# Altium project APP_1_huom2704.PrjPcb (part 1 of 2)
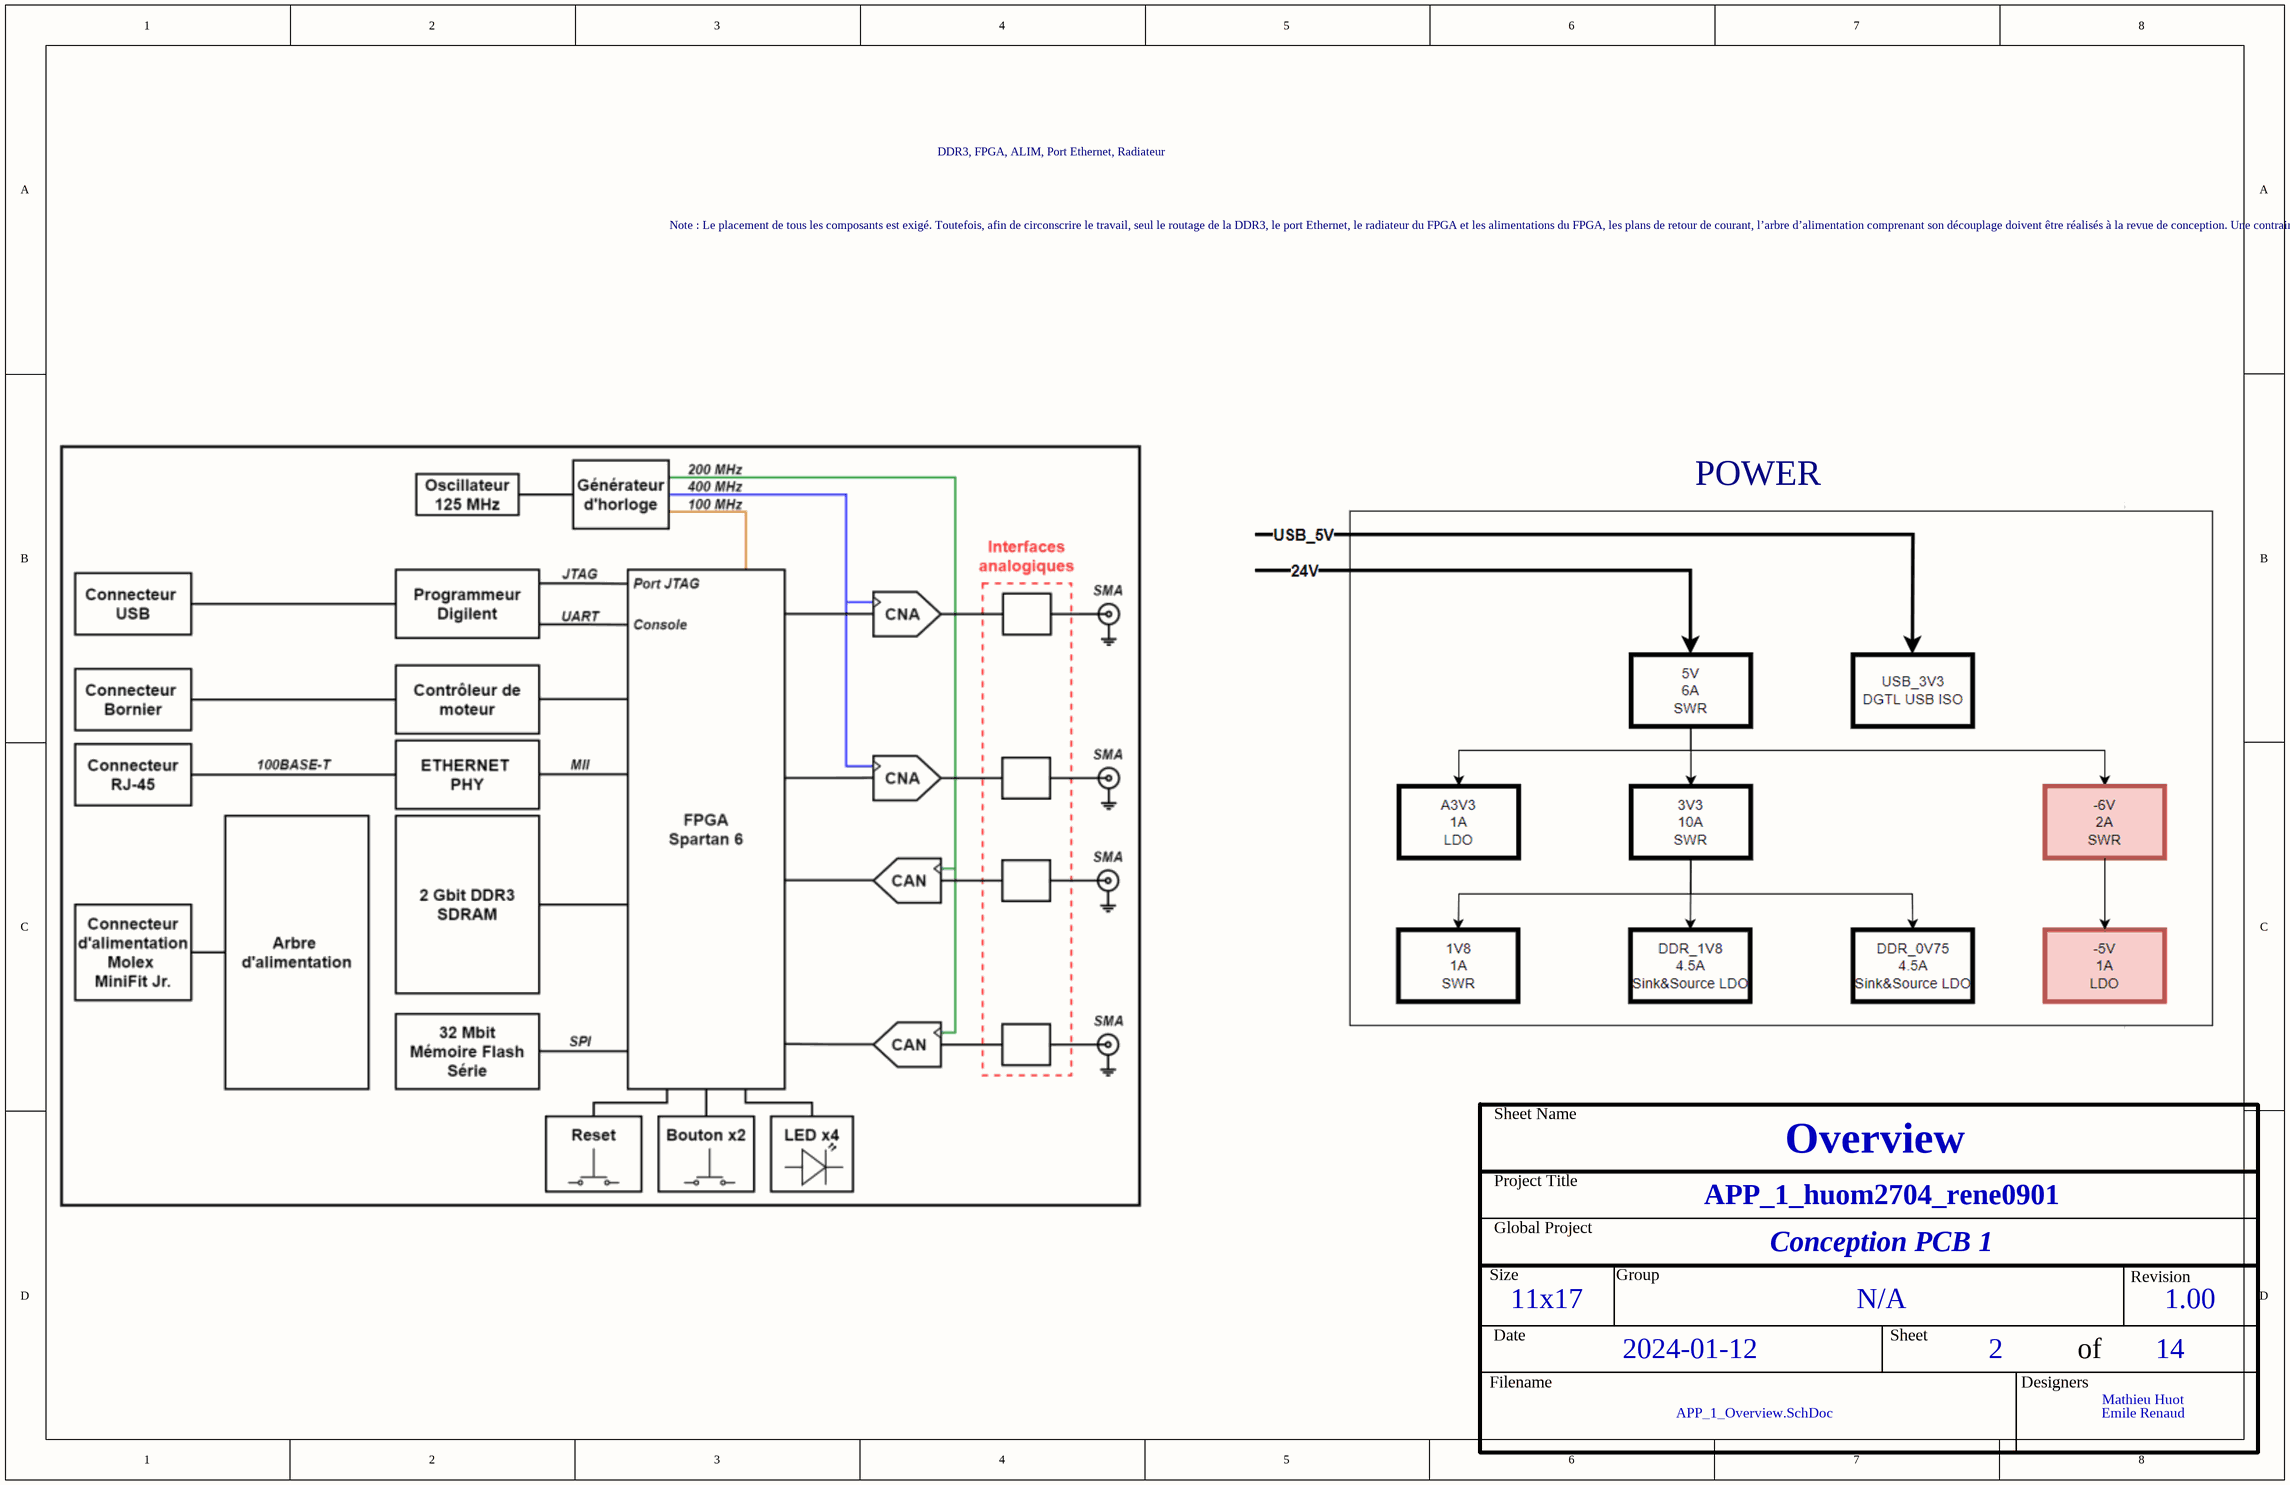
[diagram p0: APP_1_Overview.SchDoc]
Project_Date: 2024-01-12; Project_Designer1: Mathieu Huot; Project_Designer2: Emile Renaud; Project_Global: Conception PCB 1; Project_Group: N/A; Project_Name: APP_1_huom2704_rene0901; Project_Revision: 1.00
8 sheets, 180 parts. Net scope: flat (ports and power ports of the same name join across sheets).
Board file: APP_EMILE.PcbDoc
Sheets:
  APP_1_Overview.SchDoc
  APP_1_Ethernet_m.SchDoc
  APP_1_FPGA_m.SchDoc
  APP_1_PLL_m.SchDoc
  APP_1_DAC_m.SchDoc
  APP_1_ADC_m.SchDoc
  APP_1_JTAG_m.SchDoc
  APP_1_PowerAnalog.SchDoc

## Sheet APP_1_Overview.SchDoc: Overview
size Tabloid; DocumentNumber: 2; SheetNumber: 2; SheetTotal: 14; Sheet_Name: Overview; Size: 11x17

### Notes on the sheet
- DDR3, FPGA, ALIM, Port Ethernet, Radiateur
- Note : Le placement de tous les composants est exigé. Toutefois, afin de circonscrire le travail, seul le routage de la DDR3, le port Ethernet, le radiateur du FPGA et les alimentations du FPGA, les plans de retour de courant, l’arbre d’alimentation comprenant son découplage doivent être réalisés à la revue de conception. Une contrainte est exigée pour le routage entre le FPGA et la DDR3 où on exige une distance de 2 cm entre les 2 composants. Il faut spécifier, sans router les traces (épaisseurs, largeur, vias etc…) du contrôleur de moteur jusqu’au connecteur. L’équipe doit fournir un mini rapport de 1 page expliquant les choix technologiques pour l’empilement (stack-up), les matériaux et les épaisseurs de cuivre. Cette page correspond à votre travail en tant qu’ingénieur de conception.
- POWER
- Sheet Name
- Project Title
- Global Project
- Size
- Group
- Revision
- Date
- Sheet
- of
- Filename
- Designers

## Sheet APP_1_Ethernet_m.SchDoc
size Tabloid; SheetNumber: 11; SheetTotal: 16; Sheet_Name: Ethernet; Size: 11x17
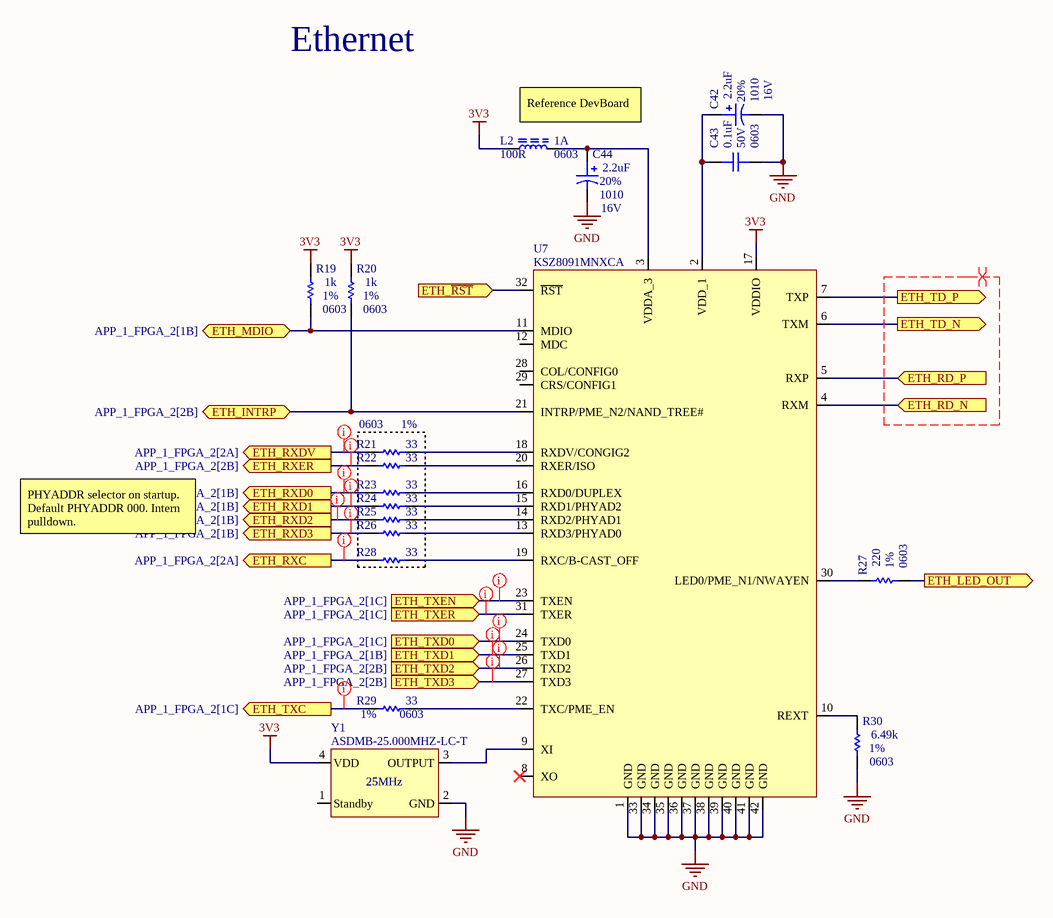
[diagram p1: APP_1_Ethernet_m.SchDoc]

### Parts
C42  value 2.2uF  Voltage: 16V  Package: 1010  Precision: 20%  [CAP_ALU_1010_vishay]  (hidden comment: MAL214699501E3)
C43  value 0.1uF  Voltage: 50V  Package: 0603  [CAP_0603]  (hidden comment: CAP - 0603)
C44  value 2.2uF  Voltage: 16V  Package: 1010  Precision: 20%  [CAP_ALU_1010_vishay]  (hidden comment: MAL214699501E3)
L2  value 100R  Current: 1A  Package: 0603  [FER_0603]  (hidden comment: FER - 0603)
R19  value 1k  Package: 0603  Precision: 1%  [RES_0603]  (hidden comment: RES - 0603)
R20  value 1k  Package: 0603  Precision: 1%  [RES_0603]  (hidden comment: RES - 0603)
R21  value 33  Package: 0603  Precision: 1%  [RES_0603]  (hidden comment: RES - 0603)
R22  value 33  [RES_0603]  (hidden comment: RES - 0603)
R23  value 33  [RES_0603]  (hidden comment: RES - 0603)
R24  value 33  [RES_0603]  (hidden comment: RES - 0603)
R25  value 33  [RES_0603]  (hidden comment: RES - 0603)
R26  value 33  [RES_0603]  (hidden comment: RES - 0603)
R27  value 220  Package: 0603  Precision: 1%  [RES_0603]  (hidden comment: RES - 0603)
R28  value 33  [RES_0603]  (hidden comment: RES - 0603)
R29  value 33  Package: 0603  Precision: 1%  [RES_0603]  (hidden comment: RES - 0603)
R30  value 6.49k  Package: 0603  Precision: 1%  [RES_0603]  (hidden comment: RES - 0603)
U7  KSZ8091MNXCA  [COM_ETH_PHY_KSZ8091MNXCA]
Y1  ASDMB-25.000MHZ-LC-T  [OSC_ASDMB-25.000MHZ-LC-T]

### Ports
ETH_INTRP (bidir, see APP_1_FPGA_2[2B]), ETH_LED_OUT (out), ETH_MDIO (bidir, see APP_1_FPGA_2[1B]), ETH_RD_N (in, see APP_1_Connectors_m[6B]), ETH_RD_P (in, see APP_1_Connectors_m[6B]), ETH_RXC (out, see APP_1_FPGA_2[2A]), ETH_RXD0 (out, see APP_1_FPGA_2[1B]), ETH_RXD1 (out, see APP_1_FPGA_2[1B]), ETH_RXD2 (out, see APP_1_FPGA_2[1B]), ETH_RXD3 (out, see APP_1_FPGA_2[1B]), ETH_RXDV (out, see APP_1_FPGA_2[2A]), ETH_RXER (out, see APP_1_FPGA_2[2B]), ETH_TD_N (out, see APP_1_Connectors_m[6B]), ETH_TD_P (out, see APP_1_Connectors_m[6B]), ETH_TXC (out, see APP_1_FPGA_2[1C]), ETH_TXD0 (in, see APP_1_FPGA_2[1C]), ETH_TXD1 (in, see APP_1_FPGA_2[1B]), ETH_TXD2 (in, see APP_1_FPGA_2[2B]), ETH_TXD3 (in, see APP_1_FPGA_2[2B]), ETH_TXEN (in, see APP_1_FPGA_2[1C]), ETH_TXER (in, see APP_1_FPGA_2[1C]), ETH_~{RST} (in)

### Nets
3V3: L2.2 R19.2 R20.2 U7.17(VDDIO) Y1.4(VDD)
GND: C42.2 C43.1 C44.2 R30.1 U7.1(GND) U7.33(GND) U7.34(GND) U7.35(GND) U7.36(GND) U7.37(GND) U7.38(GND) U7.39(GND) U7.40(GND) U7.41(GND) U7.42(GND) Y1.2(GND)
ETH_INTRP: R20.1 U7.21(INTRP/PME_N2/NAND_TREE#) ; port ETH_INTRP
ETH_LED_OUT: R27.1 ; port ETH_LED_OUT
ETH_MDIO: R19.1 U7.11(MDIO) ; port ETH_MDIO
ETH_~{RST}: U7.32(~{RST}) ; port ETH_~{RST}
ETH_RD_N: U7.4(RXM) ; port ETH_RD_N
ETH_RD_P: U7.5(RXP) ; port ETH_RD_P
ETH_RXC: R28.2 ; port ETH_RXC
ETH_RXD0: R23.2 ; port ETH_RXD0
ETH_RXD1: R24.2 ; port ETH_RXD1
ETH_RXD2: R25.2 ; port ETH_RXD2
ETH_RXD3: R26.2 ; port ETH_RXD3
ETH_RXDV: R21.2 ; port ETH_RXDV
ETH_RXER: R22.2 ; port ETH_RXER
ETH_TD_N: U7.6(TXM) ; port ETH_TD_N
ETH_TD_P: U7.7(TXP) ; port ETH_TD_P
ETH_TXC: R29.2 ; port ETH_TXC
ETH_TXD0: U7.24(TXD0) ; port ETH_TXD0
ETH_TXD1: U7.25(TXD1) ; port ETH_TXD1
ETH_TXD2: U7.26(TXD2) ; port ETH_TXD2
ETH_TXD3: U7.27(TXD3) ; port ETH_TXD3
ETH_TXEN: U7.23(TXEN) ; port ETH_TXEN
ETH_TXER: U7.31(TXER) ; port ETH_TXER
NetC42_1: C42.1 C43.2 U7.2(VDD_1)
NetC44_1: C44.1 L2.1 U7.3(VDDA_3)
NetR21_1: R21.1 U7.18(RXDV/CONGIG2)
NetR22_1: R22.1 U7.20(RXER/ISO)
NetR23_1: R23.1 U7.16(RXD0/DUPLEX)
NetR24_1: R24.1 U7.15(RXD1/PHYAD2)
NetR25_1: R25.1 U7.14(RXD2/PHYAD1)
NetR26_1: R26.1 U7.13(RXD3/PHYAD0)
NetR27_2: R27.2 U7.30(LED0/PME_N1/NWAYEN)
NetR28_1: R28.1 U7.19(RXC/B-CAST_OFF)
NetR29_1: R29.1 U7.22(TXC/PME_EN)
NetR30_2: R30.2 U7.10(REXT)
NetU7_9: U7.9(XI) Y1.3(OUTPUT)

Not connected (* = marked no-connect by the designer): U7 8(XO)* 12(MDC) 28(COL/CONFIG0) 29(CRS/CONFIG1); Y1 1(Standby)

### Layout directives
differential pair: (no net found under the mark)
net class ETH_RX: ETH_RXC, ETH_RXD0, ETH_RXD1, ETH_RXD2, ETH_RXD3, ETH_RXDV, ETH_RXER
net class ETH_TX: ETH_TXC, ETH_TXD0, ETH_TXD1, ETH_TXD2, ETH_TXD3, ETH_TXEN, ETH_TXER

### Notes on the sheet
- Ethernet
- Reference DevBoard
- PHYADDR selector on startup. Default PHYADDR 000. Intern pulldown.
- Sheet Name
- Project Title
- Global Project
- Size
- Group
- Revision
- Date
- Sheet
- of
- Filename
- Designers

### Library data of the parts
C42 C44 = CAP_ALU_MAL214699501E3: CAP - ALU 330uF 20% 16V - 1010; Current: 750mA; Mfg: Vishay Dale; Mfg Part Number: MAL214699501E3; HelpURL: http://www.vishay.com/docs/28403/146cti.pdf; CreatedBy: Jonathan Bouchard; Temperature: -55°C to 125°C; Power: *; Supplier 1: Digikey; Supplier Part Number 1: 4405PHCT-ND
C43 = CAP - 0603: Precision: 10%; Current: *; CreatedBy: Jonathan Bouchard; Power: *
R22-R26 R28 = RES - 0603: Precision: 1%; Current: *; CreatedBy: Jonathan Bouchard; Package: 0603
U7 = COM_ETH_PHY_KSZ8091MNXCA: COM - ETHERNET PHY 10/100 - QFN-32; Voltage: 1.8V, 2.5V, 3.3V; Mfg: Micrel; Current: *; Power: *; Mfg Part Number: KSZ8091MNXCA; HelpURL: http://ww1.microchip.com/downloads/en/DeviceDoc/00002275A.pdf; CreatedBy: Jonathan Bouchard; Temperature: 0°C ~ 70°C; Value: *; Precision: *; Package: QFN-32; Supplier 1: Digikey; Supplier Part Number 1: 576-4356-ND
Y1 = OSC_ASDMB-25.000MHZ-LC-T: OSC - 25MHz XO (Standard) LVCMOS - 4-SMD, No Lead; Manufacturer #1: Abracon LLC; Tolerance: ±50ppm; Voltage Rating: 1.8V ~ 3.3V; GRAMS Lib Spec: 2.8; Magnetic Material: Unknown; Polarized: Yes; Value: 25MHz; Current Rating: *; Power Max: *; HelpURL: https://abracon.com/Oscillators/ASDMB.pdf; CreatedBy/Date: Joël Lemay 2019-03-29; VerifiedBy: C. Paulin - 29 mai 2019; Temperature: -40°C ~ +85°C; Package: 4-SMD, No Lead; Manufacturer #2: *; Note: *; Assembly Type: SMD; Part Number #2: *; Part Number #1: ASDMB-25.000MHZ-LC-T; Supplier 1: Digi-Key; Supplier Part Number 1: 535-11730-1-ND; Cryo: UNKNOWN
L2 = FER - 0603: Voltage: *; CreatedBy: Jonathan Bouchard; Power: *; Precision: *
R19-R21 R27 R29 R30 = RES - 0603: Current: *; CreatedBy: Jonathan Bouchard

## Sheet APP_1_FPGA_m.SchDoc
size Tabloid; SheetNumber: 5; SheetTotal: 16; Sheet_Name: FPGA_m; Size: 11x17
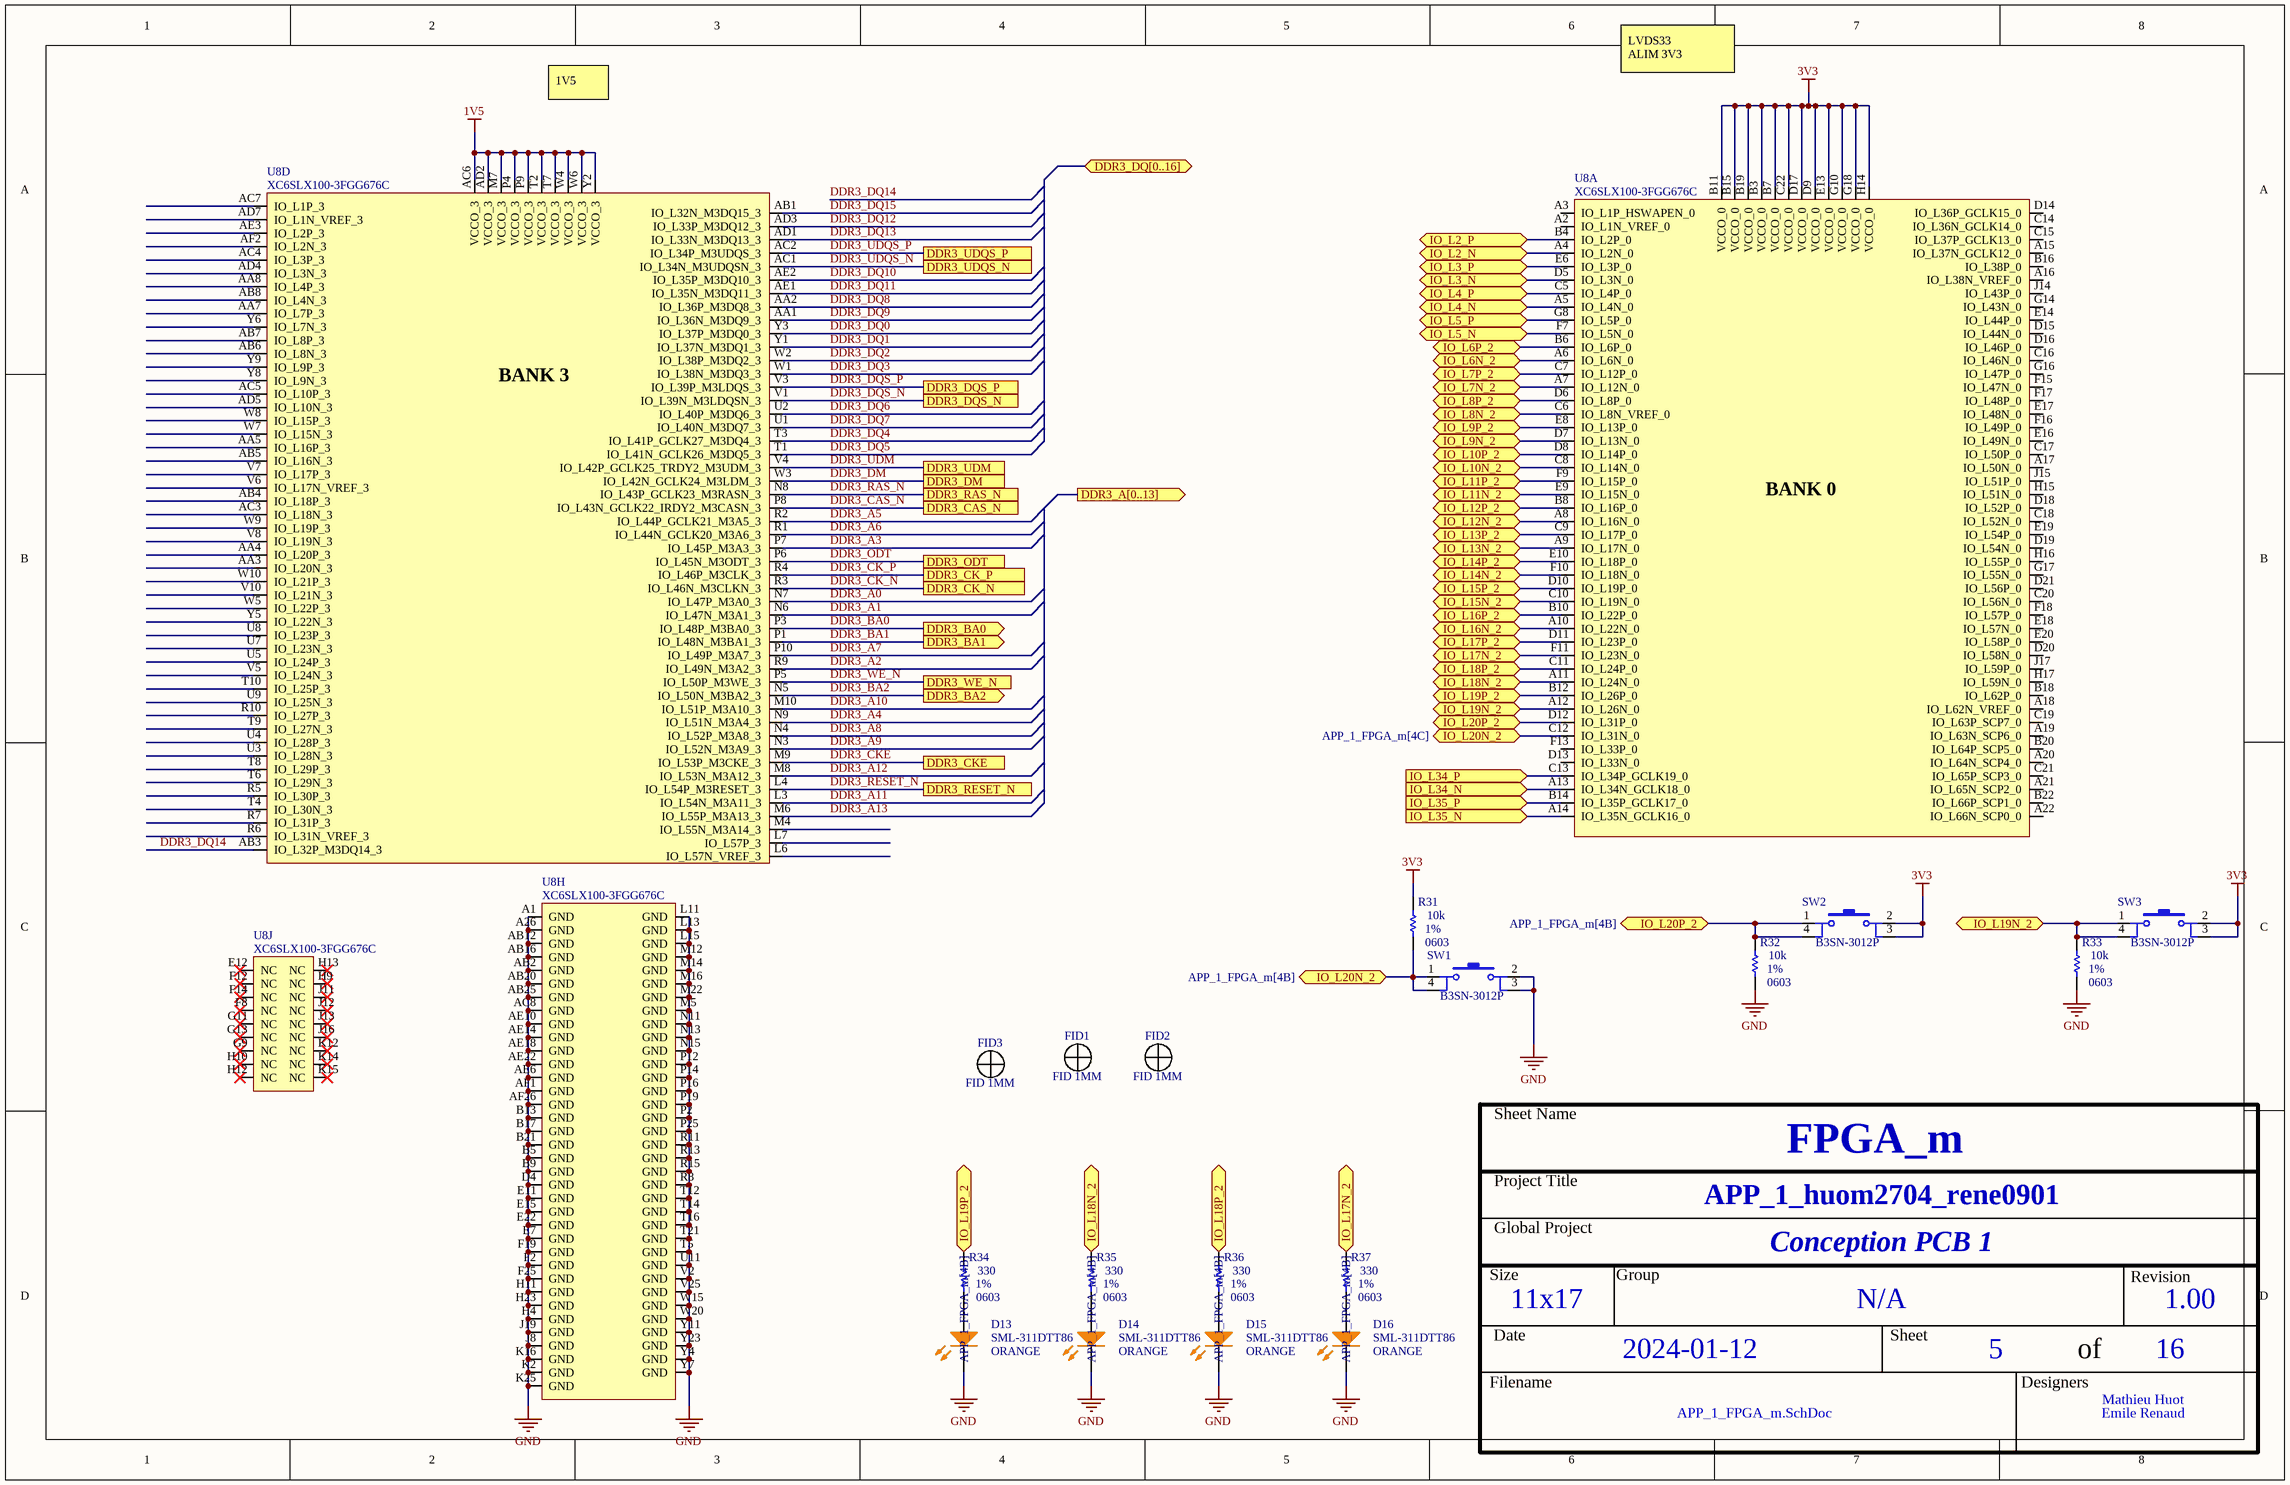
[diagram p2: APP_1_FPGA_m.SchDoc]

### Parts
D13  SML-311DTT86  value ORANGE  [LED_0603]
D14  SML-311DTT86  value ORANGE  [LED_0603]
D15  SML-311DTT86  value ORANGE  [LED_0603]
D16  SML-311DTT86  value ORANGE  [LED_0603]
FID1  FID 1MM  [FID_CIRCLE_1MM]
FID2  FID 1MM  [FID_CIRCLE_1MM]
FID3  FID 1MM  [FID_CIRCLE_1MM]
R31  value 10k  Package: 0603  Precision: 1%  [RES_0603]  (hidden comment: RES - 0603)
R32  value 10k  Package: 0603  Precision: 1%  [RES_0603]  (hidden comment: RES - 0603)
R33  value 10k  Package: 0603  Precision: 1%  [RES_0603]  (hidden comment: RES - 0603)
R34  value 330  Package: 0603  Precision: 1%  [RES_0603]  (hidden comment: RES - 0603)
R35  value 330  Package: 0603  Precision: 1%  [RES_0603]  (hidden comment: RES - 0603)
R36  value 330  Package: 0603  Precision: 1%  [RES_0603]  (hidden comment: RES - 0603)
R37  value 330  Package: 0603  Precision: 1%  [RES_0603]  (hidden comment: RES - 0603)
SW1  B3SN-3012P  [SWI_TACT_B3SN-3012P]
SW2  B3SN-3012P  [SWI_TACT_B3SN-3012P]
SW3  B3SN-3012P  [SWI_TACT_B3SN-3012P]
U8  XC6SLX100-3FGG676C  [FPGA_XILINX_FGG676]  (parts A,D,H,J of 10)

### Ports
DDR3_A[0..13] (out, see APP_1_DDR3_m[1B]), DDR3_BA0 (out, see APP_1_DDR3_m[2C]), DDR3_BA1 (out, see APP_1_DDR3_m[2C]), DDR3_BA2 (out, see APP_1_DDR3_m[2C]), DDR3_CAS_N (see APP_1_DDR3_m[2C]), DDR3_CK_N (see APP_1_DDR3_m[1C]), DDR3_CK_P (see APP_1_DDR3_m[1C]), DDR3_CKE, DDR3_DM, DDR3_DQ[0..16] (bidir, see APP_1_DDR3_m[4B]), DDR3_DQS_N, DDR3_DQS_P, DDR3_ODT (see APP_1_DDR3_m[2C]), DDR3_RAS_N (see APP_1_DDR3_m[2C]), DDR3_RESET_N, DDR3_UDM (see APP_1_DDR3_m[4C]), DDR3_UDQS_N (see APP_1_DDR3_m[4C]), DDR3_UDQS_P (see APP_1_DDR3_m[4C]), DDR3_WE_N (see APP_1_DDR3_m[2C]), IO_L2_N (bidir), IO_L2_P (bidir), IO_L3_N (bidir), IO_L3_P (bidir), IO_L4_N (bidir), IO_L4_P (bidir), IO_L5_N (bidir), IO_L5_P (bidir), IO_L6N_2 (bidir), IO_L6P_2 (bidir), IO_L7N_2 (bidir), IO_L7P_2 (bidir), IO_L8N_2 (bidir), IO_L8P_2 (bidir), IO_L9N_2 (bidir), IO_L9P_2 (bidir), IO_L10N_2 (bidir), IO_L10P_2 (bidir), IO_L11N_2 (bidir), IO_L11P_2 (bidir), IO_L12N_2 (bidir), IO_L12P_2 (bidir), IO_L13N_2 (bidir), IO_L13P_2 (bidir), IO_L14N_2 (bidir), IO_L14P_2 (bidir), IO_L15N_2 (bidir), IO_L15P_2 (bidir), IO_L16N_2 (bidir), IO_L16P_2 (bidir), IO_L17N_2 (bidir), IO_L17N_2 (bidir, see APP_1_FPGA_m[4B]), IO_L17P_2 (bidir), IO_L18N_2 (bidir), IO_L18N_2 (bidir, see APP_1_FPGA_m[4B]), IO_L18P_2 (bidir), IO_L18P_2 (bidir, see APP_1_FPGA_m[4B]), IO_L19N_2 (bidir), IO_L19P_2 (bidir), IO_L19P_2 (bidir, see APP_1_FPGA_m[4B]), IO_L20N_2 (bidir, see APP_1_FPGA_m[4B]), IO_L20N_2 (bidir, see APP_1_FPGA_m[4C]), IO_L20P_2 (bidir), IO_L20P_2 (bidir, see APP_1_FPGA_m[4B]), IO_L34_N (in), IO_L34_P (in), IO_L35_N (in), IO_L35_P (in)

### Nets
1V5: U8.AC6(VCCO_3) U8.AD2(VCCO_3) U8.M7(VCCO_3) U8.P4(VCCO_3) U8.P9(VCCO_3) U8.T2(VCCO_3) U8.T7(VCCO_3) U8.W4(VCCO_3) U8.W6(VCCO_3) U8.Y2(VCCO_3)
3V3: R31.2 SW2.2 SW2.3 SW3.2 SW3.3 U8.B3(VCCO_0) U8.B7(VCCO_0) U8.B11(VCCO_0) U8.B15(VCCO_0) U8.B19(VCCO_0) U8.C22(VCCO_0) U8.D9(VCCO_0) U8.D17(VCCO_0) U8.E13(VCCO_0) U8.G10(VCCO_0) U8.G18(VCCO_0) U8.H14(VCCO_0)
GND: D13.K D14.K D15.K D16.K R32.1 R33.1 SW1.2 SW1.3 U8.A1(GND) U8.A26(GND) U8.AB2(GND) U8.AB12(GND) U8.AB16(GND) U8.AB20(GND) U8.AB25(GND) U8.AC8(GND) U8.AE6(GND) U8.AE10(GND) U8.AE14(GND) U8.AE18(GND) U8.AE22(GND) U8.AF1(GND) U8.AF26(GND) U8.B5(GND) U8.B9(GND) U8.B13(GND) U8.B17(GND) U8.B21(GND) U8.D4(GND) U8.E7(GND) U8.E11(GND) U8.E15(GND) U8.E22(GND) U8.F2(GND) U8.F19(GND) U8.F25(GND) U8.H4(GND) U8.H11(GND) U8.H23(GND) U8.J8(GND) U8.J19(GND) U8.K2(GND) U8.K16(GND) U8.K25(GND) U8.L11(GND) U8.L13(GND) U8.L15(GND) U8.M5(GND) U8.M12(GND) U8.M14(GND) U8.M16(GND) U8.M22(GND) U8.N11(GND) U8.N13(GND) U8.N15(GND) U8.P2(GND) U8.P12(GND) U8.P14(GND) U8.P16(GND) U8.P19(GND) U8.P25(GND) U8.R8(GND) U8.R11(GND) U8.R13(GND) U8.R15(GND) U8.T5(GND) U8.T12(GND) U8.T14(GND) U8.T16(GND) U8.T21(GND) U8.U11(GND) U8.V2(GND) U8.V25(GND) U8.W15(GND) U8.W20(GND) U8.Y4(GND) U8.Y7(GND) U8.Y11(GND) U8.Y23(GND)
DDR3_A0: U8.N7(IO_L47P_M3A0_3)
DDR3_A1: U8.N6(IO_L47N_M3A1_3)
DDR3_A2: U8.R9(IO_L49N_M3A2_3)
DDR3_A3: U8.P7(IO_L45P_M3A3_3)
DDR3_A4: U8.N9(IO_L51N_M3A4_3)
DDR3_A5: U8.R2(IO_L44P_GCLK21_M3A5_3)
DDR3_A6: U8.R1(IO_L44N_GCLK20_M3A6_3)
DDR3_A7: U8.P10(IO_L49P_M3A7_3)
DDR3_A8: U8.N4(IO_L52P_M3A8_3)
DDR3_A9: U8.N3(IO_L52N_M3A9_3)
DDR3_A10: U8.M10(IO_L51P_M3A10_3)
DDR3_A11: U8.L3(IO_L54N_M3A11_3)
DDR3_A12: U8.M8(IO_L53N_M3A12_3)
DDR3_A13: U8.M6(IO_L55P_M3A13_3)
DDR3_BA0: U8.P3(IO_L48P_M3BA0_3) ; port DDR3_BA0
DDR3_BA1: U8.P1(IO_L48N_M3BA1_3) ; port DDR3_BA1
DDR3_BA2: U8.N5(IO_L50N_M3BA2_3) ; port DDR3_BA2
DDR3_CAS_N: U8.P8(IO_L43N_GCLK22_IRDY2_M3CASN_3) ; port DDR3_CAS_N
DDR3_CK_N: U8.R3(IO_L46N_M3CLKN_3) ; port DDR3_CK_N
DDR3_CK_P: U8.R4(IO_L46P_M3CLK_3) ; port DDR3_CK_P
DDR3_CKE: U8.M9(IO_L53P_M3CKE_3) ; port DDR3_CKE
DDR3_DM: U8.W3(IO_L42N_GCLK24_M3LDM_3) ; port DDR3_DM
DDR3_DQ0: U8.Y3(IO_L37P_M3DQ0_3)
DDR3_DQ1: U8.Y1(IO_L37N_M3DQ1_3)
DDR3_DQ2: U8.W2(IO_L38P_M3DQ2_3)
DDR3_DQ3: U8.W1(IO_L38N_M3DQ3_3)
DDR3_DQ4: U8.T3(IO_L41P_GCLK27_M3DQ4_3)
DDR3_DQ5: U8.T1(IO_L41N_GCLK26_M3DQ5_3)
DDR3_DQ6: U8.U2(IO_L40P_M3DQ6_3)
DDR3_DQ7: U8.U1(IO_L40N_M3DQ7_3)
DDR3_DQ8: U8.AA2(IO_L36P_M3DQ8_3)
DDR3_DQ9: U8.AA1(IO_L36N_M3DQ9_3)
DDR3_DQ10: U8.AE2(IO_L35P_M3DQ10_3)
DDR3_DQ11: U8.AE1(IO_L35N_M3DQ11_3)
DDR3_DQ12: U8.AD3(IO_L33P_M3DQ12_3)
DDR3_DQ13: U8.AD1(IO_L33N_M3DQ13_3)
DDR3_DQ14: U8.AB3(IO_L32P_M3DQ14_3)
DDR3_DQ15: U8.AB1(IO_L32N_M3DQ15_3)
DDR3_DQS_N: U8.V1(IO_L39N_M3LDQSN_3) ; port DDR3_DQS_N
DDR3_DQS_P: U8.V3(IO_L39P_M3LDQS_3) ; port DDR3_DQS_P
DDR3_ODT: U8.P6(IO_L45N_M3ODT_3) ; port DDR3_ODT
DDR3_RAS_N: U8.N8(IO_L43P_GCLK23_M3RASN_3) ; port DDR3_RAS_N
DDR3_RESET_N: U8.L4(IO_L54P_M3RESET_3) ; port DDR3_RESET_N
DDR3_UDM: U8.V4(IO_L42P_GCLK25_TRDY2_M3UDM_3) ; port DDR3_UDM
DDR3_UDQS_N: U8.AC1(IO_L34N_M3UDQSN_3) ; port DDR3_UDQS_N
DDR3_UDQS_P: U8.AC2(IO_L34P_M3UDQS_3) ; port DDR3_UDQS_P
DDR3_WE_N: U8.P5(IO_L50P_M3WE_3) ; port DDR3_WE_N
IO_L2_N: U8.A4(IO_L2N_0) ; port IO_L2_N
IO_L2_P: U8.B4(IO_L2P_0) ; port IO_L2_P
IO_L3_N: U8.D5(IO_L3N_0) ; port IO_L3_N
IO_L3_P: U8.E6(IO_L3P_0) ; port IO_L3_P
IO_L4_N: U8.A5(IO_L4N_0) ; port IO_L4_N
IO_L4_P: U8.C5(IO_L4P_0) ; port IO_L4_P
IO_L5_N: U8.F7(IO_L5N_0) ; port IO_L5_N
IO_L5_P: U8.G8(IO_L5P_0) ; port IO_L5_P
IO_L6N_2: U8.A6(IO_L6N_0) ; port IO_L6N_2
IO_L6P_2: U8.B6(IO_L6P_0) ; port IO_L6P_2
IO_L7N_2: U8.A7(IO_L12N_0) ; port IO_L7N_2
IO_L7P_2: U8.C7(IO_L12P_0) ; port IO_L7P_2
IO_L8N_2: U8.C6(IO_L8N_VREF_0) ; port IO_L8N_2
IO_L8P_2: U8.D6(IO_L8P_0) ; port IO_L8P_2
IO_L9N_2: U8.D7(IO_L13N_0) ; port IO_L9N_2
IO_L9P_2: U8.E8(IO_L13P_0) ; port IO_L9P_2
IO_L10N_2: U8.C8(IO_L14N_0) ; port IO_L10N_2
IO_L10P_2: U8.D8(IO_L14P_0) ; port IO_L10P_2
IO_L11N_2: U8.E9(IO_L15N_0) ; port IO_L11N_2
IO_L11P_2: U8.F9(IO_L15P_0) ; port IO_L11P_2
IO_L12N_2: U8.A8(IO_L16N_0) ; port IO_L12N_2
IO_L12P_2: U8.B8(IO_L16P_0) ; port IO_L12P_2
IO_L13N_2: U8.A9(IO_L17N_0) ; port IO_L13N_2
IO_L13P_2: U8.C9(IO_L17P_0) ; port IO_L13P_2
IO_L14N_2: U8.F10(IO_L18N_0) ; port IO_L14N_2
IO_L14P_2: U8.E10(IO_L18P_0) ; port IO_L14P_2
IO_L15N_2: U8.C10(IO_L19N_0) ; port IO_L15N_2
IO_L15P_2: U8.D10(IO_L19P_0) ; port IO_L15P_2
IO_L16N_2: U8.A10(IO_L22N_0) ; port IO_L16N_2
IO_L16P_2: U8.B10(IO_L22P_0) ; port IO_L16P_2
IO_L17N_2: R37.2 U8.F11(IO_L23N_0) ; port IO_L17N_2
IO_L17P_2: U8.D11(IO_L23P_0) ; port IO_L17P_2
IO_L18N_2: R35.2 U8.A11(IO_L24N_0) ; port IO_L18N_2
IO_L18P_2: R36.2 U8.C11(IO_L24P_0) ; port IO_L18P_2
IO_L19N_2: R33.2 SW3.1 SW3.4 U8.A12(IO_L26N_0) ; port IO_L19N_2
IO_L19P_2: R34.2 U8.B12(IO_L26P_0) ; port IO_L19P_2
IO_L20N_2: R31.1 SW1.1 SW1.4 U8.C12(IO_L31N_0) ; port IO_L20N_2
IO_L20P_2: R32.2 SW2.1 SW2.4 U8.D12(IO_L31P_0) ; port IO_L20P_2
IO_L34_N: U8.A13(IO_L34N_GCLK18_0) ; port IO_L34_N
IO_L34_P: U8.C13(IO_L34P_GCLK19_0) ; port IO_L34_P
IO_L35_N: U8.A14(IO_L35N_GCLK16_0) ; port IO_L35_N
IO_L35_P: U8.B14(IO_L35P_GCLK17_0) ; port IO_L35_P
NetD13_A: D13.A R34.1
NetD14_A: D14.A R35.1
NetD15_A: D15.A R36.1
NetD16_A: D16.A R37.1

Not connected (* = marked no-connect by the designer): FID1 1 2; FID2 1 2; FID3 1 2; U8 A2(IO_L1N_VREF_0) A3(IO_L1P_HSWAPEN_0) A15(IO_L37N_GCLK12_0) A16(IO_L38N_VREF_0) A17(IO_L50N_0) A18(IO_L62N_VREF_0) A19(IO_L63N_SCP6_0) A20(IO_L64N_SCP4_0) A21(IO_L65N_SCP2_0) A22(IO_L66N_SCP0_0) AA3(IO_L20N_3) AA4(IO_L20P_3) AA5(IO_L16P_3) AA7(IO_L7P_3) AA8(IO_L4P_3) AB4(IO_L18P_3) AB5(IO_L16N_3) AB6(IO_L8N_3) AB7(IO_L8P_3) AB8(IO_L4N_3) AC3(IO_L18N_3) AC4(IO_L3P_3) AC5(IO_L10P_3) AC7(IO_L1P_3) AD4(IO_L3N_3) AD5(IO_L10N_3) AD7(IO_L1N_VREF_3) AE3(IO_L2P_3) AF2(IO_L2N_3) B16(IO_L38P_0) B18(IO_L62P_0) B20(IO_L64P_SCP5_0) B22(IO_L66P_SCP1_0) C14(IO_L36N_GCLK14_0) C15(IO_L37P_GCLK13_0) C16(IO_L46N_0) C17(IO_L50P_0) C18(IO_L52N_0) C19(IO_L63P_SCP7_0) C20(IO_L56N_0) C21(IO_L65P_SCP3_0) D13(IO_L33N_0) D14(IO_L36P_GCLK15_0) D15(IO_L44N_0) D16(IO_L46P_0) D18(IO_L52P_0) D19(IO_L54N_0) D20(IO_L58N_0) D21(IO_L56P_0) E12(NC)* E14(IO_L44P_0) E16(IO_L49N_0) E17(IO_L48N_0) E18(IO_L57N_0) E19(IO_L54P_0) E20(IO_L58P_0) F8(NC)* F12(NC)* F13(IO_L33P_0) F14(NC)* F15(IO_L47N_0) F16(IO_L49P_0) F17(IO_L48P_0) F18(IO_L57P_0) G9(NC)* G11(NC)* G13(NC)* G14(IO_L43N_0) G16(IO_L47P_0) G17(IO_L55N_0) H9(NC)* H10(NC)* H12(NC)* H13(NC)* H15(IO_L51N_0) H16(IO_L55P_0) H17(IO_L59N_0) J11(NC)* J12(NC)* J13(NC)* J14(IO_L43P_0) J15(IO_L51P_0) J16(NC)* J17(IO_L59P_0) K12(NC)* K14(NC)* K15(NC)* L6(IO_L57N_VREF_3) L7(IO_L57P_3) M4(IO_L55N_M3A14_3) R5(IO_L30P_3) R6(IO_L31N_VREF_3) R7(IO_L31P_3) R10(IO_L27P_3) T4(IO_L30N_3) T6(IO_L29N_3) T8(IO_L29P_3) T9(IO_L27N_3) T10(IO_L25P_3) U3(IO_L28N_3) U4(IO_L28P_3) U5(IO_L24P_3) U7(IO_L23N_3) U8(IO_L23P_3) U9(IO_L25N_3) V5(IO_L24N_3) V6(IO_L17N_VREF_3) V7(IO_L17P_3) V8(IO_L19N_3) V10(IO_L21N_3) W5(IO_L22P_3) W7(IO_L15N_3) W8(IO_L15P_3) W9(IO_L19P_3) W10(IO_L21P_3) Y5(IO_L22N_3) Y6(IO_L7N_3) Y8(IO_L9N_3) Y9(IO_L9P_3)

### Notes on the sheet
- 1V5
- LVDS33
  ALIM 3V3
- Sheet Name
- Project Title
- Global Project
- Size
- Group
- Revision
- Date
- Sheet
- of
- Filename
- Designers
- (in symbol FPGA_XC6SLX100-3FGG676C, part A) BANK 0
- (in symbol FPGA_XC6SLX100-3FGG676C, part D) BANK 3

### Library data of the parts
D13-D16 = LED_SML-311DTT86: LED - 611nM ORANGE 2mA - 0603; Voltage: 1.8V; Mfg: ROHM Semiconductor; Power: 44mW; Current: 2mA; HelpURL: http://media.digikey.com/pdf/Data%20Sheets/Rohm%20PDFs/SML-311%20Series.pdf; CreatedBy: Jonathan Bouchard; Temperature: -40°C to 85°C; Package: 0603; Precision: *; Mfg Part Number: SML-311DTT86; Supplier 1: Digikey; Supplier Part Number 1: 511-1303-1-ND
FID1-FID3 = FID_CIRCLE_1MM: FID - FIDUCIAL 1MM CIRCLE DOUBLE-SIDED - 1MM; GRAMS Lib Spec: 2.8; Magnetic Material: NO; Cryo: UNKNOWN; Value: *; Tolerance: *; Voltage Rating: *; Current Rating: *; Power Max: *; HelpURL: https://www.pcb-3d.com/wordpress/wp-content/uploads/ipc-sm-782a_amendment_1_and_2.pdf; CreatedBy/Date: Jonathan Bouchard 2018-07-23; VerifiedBy: Caroline Paulin - 25 juillet 2018; Temperature: *; Package: 1MM CIRCLE; Manufacturer #1: *; Manufacturer #2: *; Note: *; Assembly Type: NONE; Part Number #2: *; Part Number #1: *; Polarized: *; Supplier 1: *; Supplier Part Number 1: *
SW1-SW3 = SWI_TACT_B3SN-3012P: SWI - TACT SPST-NO 0.05A 24V - 4-SMD; Current: 50mA; Mfg: Omron; Mfg Part Number: B3SN-3012P; HelpURL: http://www.omron.com/ecb/products/pdf/en-b3sn.pdf; CreatedBy: Jonathan Bouchard; Temperature: -25°C ~ 70°C; Power: *; Precision: *; Package: 4-SMD; Value: *; Voltage: 24V; Supplier 1: Digikey; Supplier Part Number 1: SW261CT-ND
U8 = FPGA_XC6SLX100-3FGG676C: FPGA - XILINX SPARTAN 6 480 I/O - BGA-676; Voltage: 1.14 V ~ 1.26 V; Current: *; Power: *; Mfg: Xilinx; Mfg Part Number: XC6SLX100-3FGG676C; HelpURL: https://www.xilinx.com/support/documentation/data_sheets/ds162.pdf; CreatedBy: Jonathan Bouchard; Temperature: 0°C ~ 85°C (TJ); Value: *; Precision: *; Package: BGA-676; Supplier 1: Digikey; Supplier Part Number 1: 122-1760-ND
R31-R37 = RES - 0603: Current: *; CreatedBy: Jonathan Bouchard

## Sheet APP_1_PLL_m.SchDoc
size Tabloid; SheetNumber: 7; SheetTotal: 14; Sheet_Name: PLL; Size: 11x17
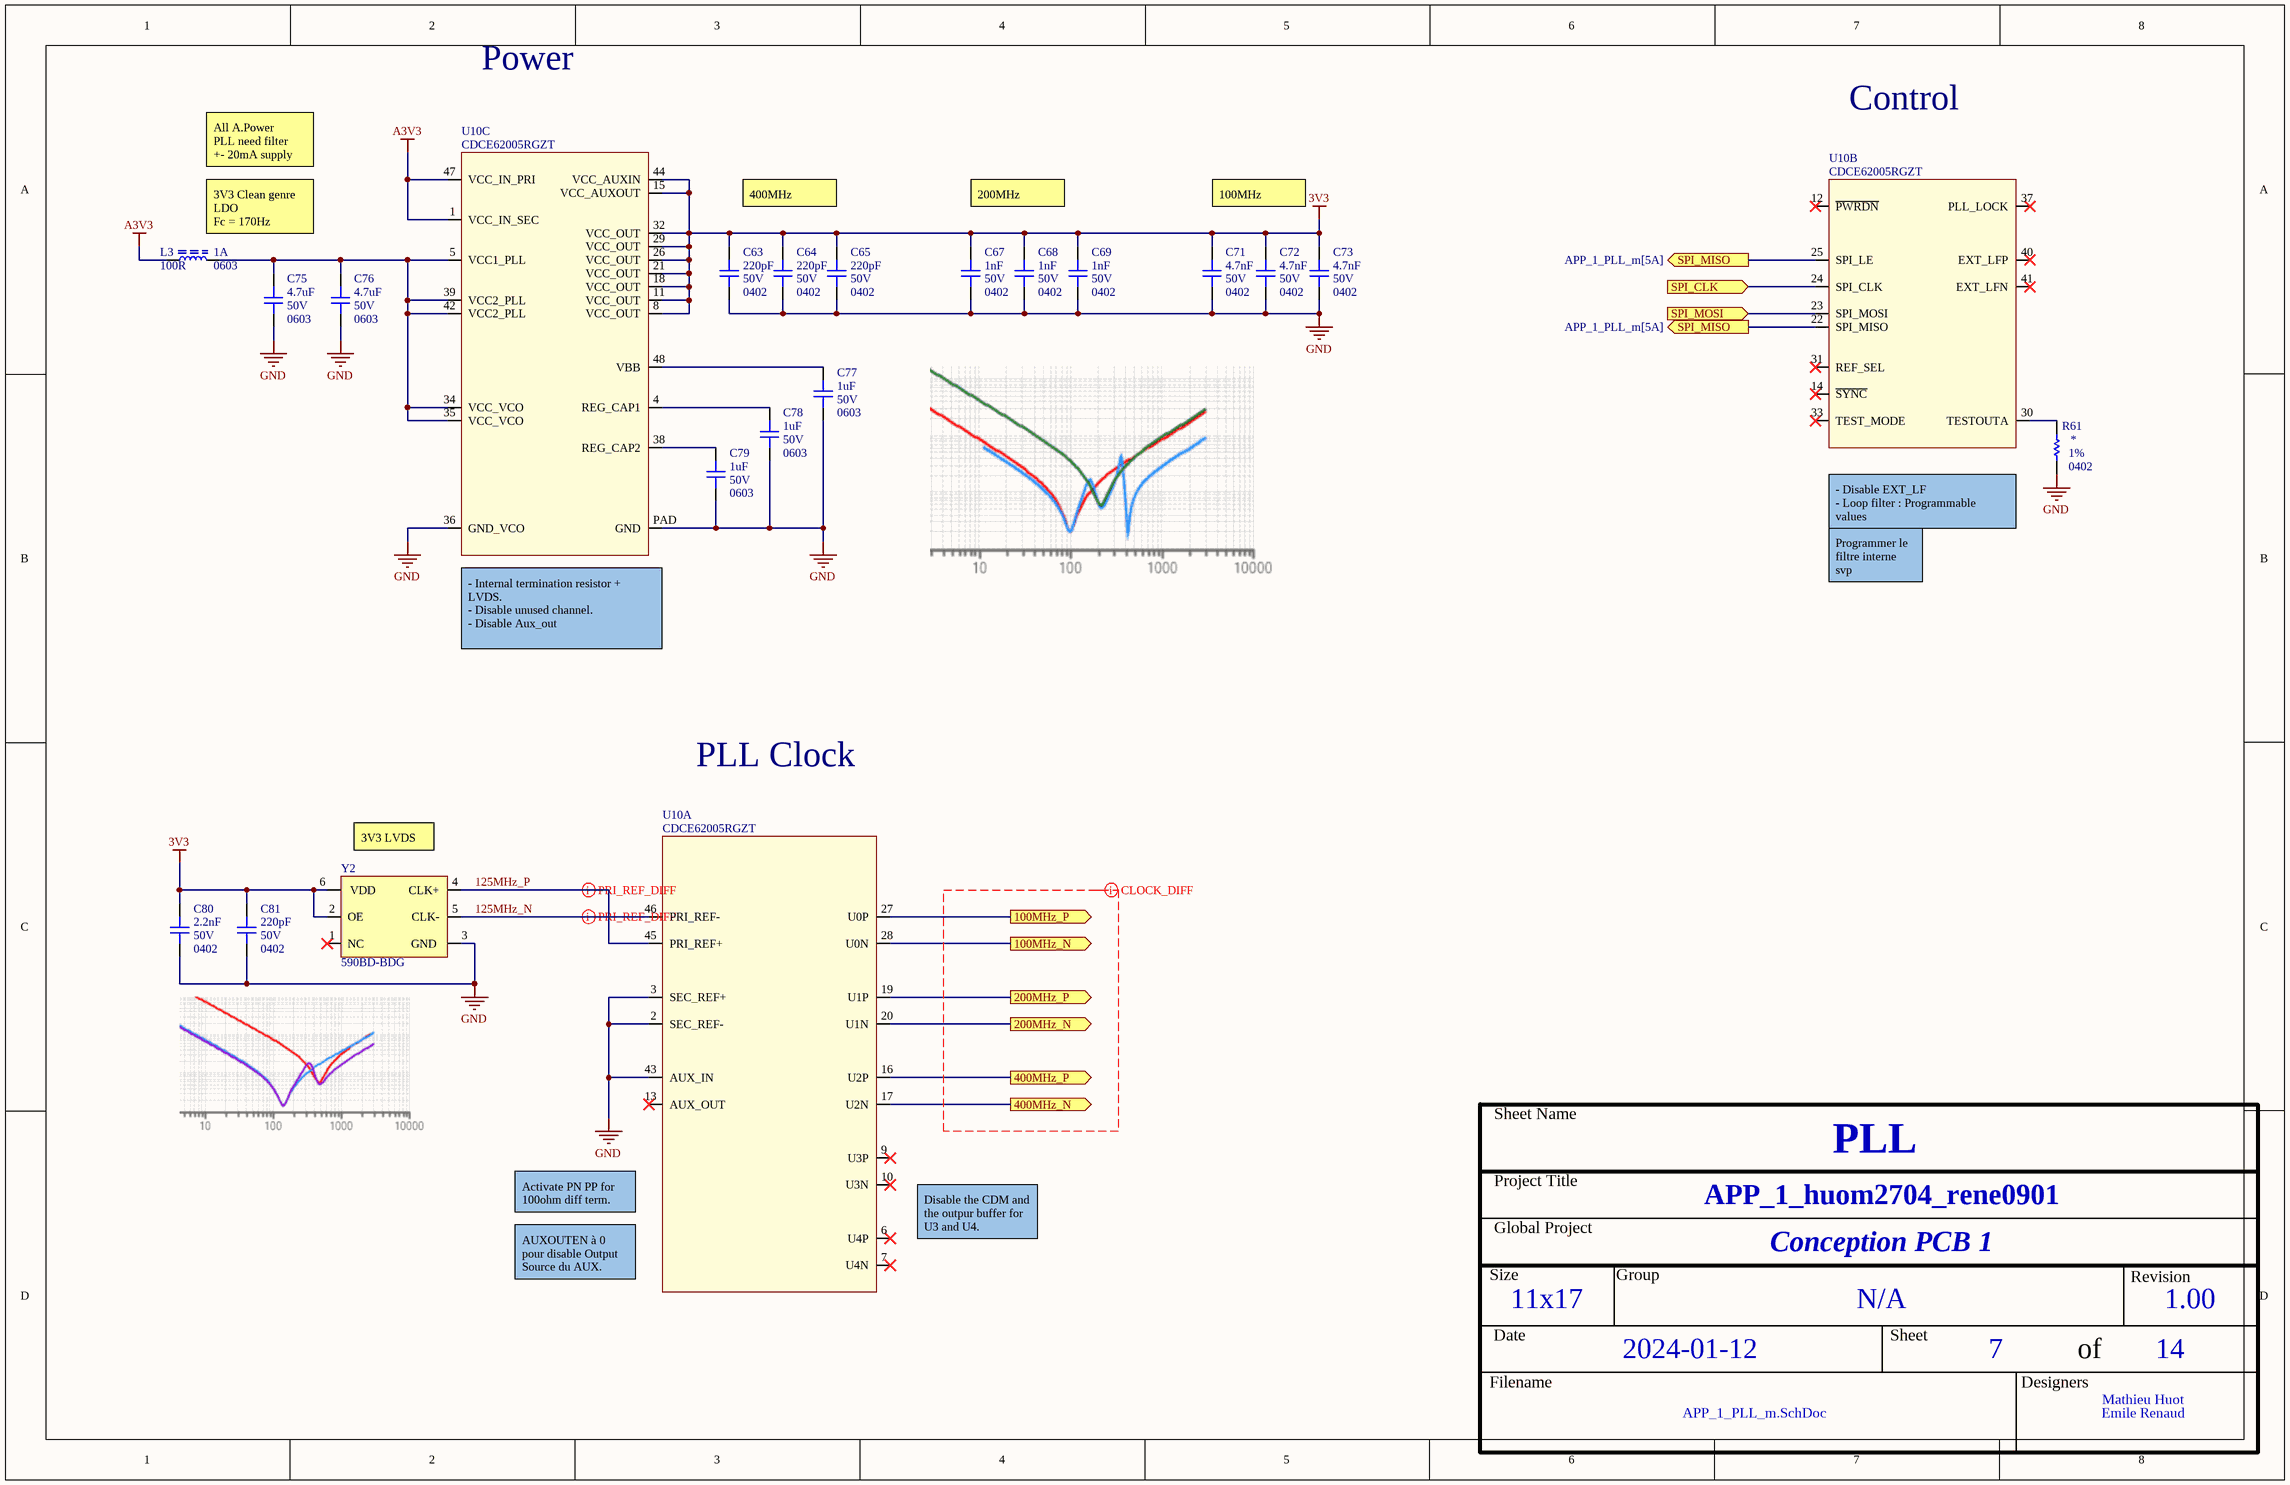
[diagram p3: APP_1_PLL_m.SchDoc]

### Parts
C63  value 220pF  Voltage: 50V  Package: 0402  [CAP_0402]  (hidden comment: CAP - 0402)
C64  value 220pF  Voltage: 50V  Package: 0402  [CAP_0402]  (hidden comment: CAP - 0402)
C65  value 220pF  Voltage: 50V  Package: 0402  [CAP_0402]  (hidden comment: CAP - 0402)
C67  value 1nF  Voltage: 50V  Package: 0402  [CAP_0402]  (hidden comment: CAP - 0402)
C68  value 1nF  Voltage: 50V  Package: 0402  [CAP_0402]  (hidden comment: CAP - 0402)
C69  value 1nF  Voltage: 50V  Package: 0402  [CAP_0402]  (hidden comment: CAP - 0402)
C71  value 4.7nF  Voltage: 50V  Package: 0402  [CAP_0402]  (hidden comment: CAP - 0402)
C72  value 4.7nF  Voltage: 50V  Package: 0402  [CAP_0402]  (hidden comment: CAP - 0402)
C73  value 4.7nF  Voltage: 50V  Package: 0402  [CAP_0402]  (hidden comment: CAP - 0402)
C75  value 4.7uF  Voltage: 50V  Package: 0603  [CAP_0603]  (hidden comment: CAP - 0603)
C76  value 4.7uF  Voltage: 50V  Package: 0603  [CAP_0603]  (hidden comment: CAP - 0603)
C77  value 1uF  Voltage: 50V  Package: 0603  [CAP_0603]  (hidden comment: CAP - 0603)
C78  value 1uF  Voltage: 50V  Package: 0603  [CAP_0603]  (hidden comment: CAP - 0603)
C79  value 1uF  Voltage: 50V  Package: 0603  [CAP_0603]  (hidden comment: CAP - 0603)
C80  value 2.2nF  Voltage: 50V  Package: 0402  [CAP_0402]  (hidden comment: CAP - 0402)
C81  value 220pF  Voltage: 50V  Package: 0402  [CAP_0402]  (hidden comment: CAP - 0402)
L3  value 100R  Current: 1A  Package: 0603  [FER_0603]  (hidden comment: FER - 0603)
R61  Package: 0402  Precision: 1%  [RES_0402]  (hidden comment: RES - 0402)
U10  CDCE62005RGZT  [TIM_CDCE62005RGZT]  (parts A,B,C of 3)
Y2  590BD-BDG  [OSC_590BD-BDG]

### Ports
100MHz_N (out), 100MHz_P (out), 200MHz_N (out, see APP_1_DAC_m[1B]), 200MHz_P (out, see APP_1_DAC_m[1B]), 400MHz_N (out, see APP_1_DAC_m[1B]), 400MHz_P (out, see APP_1_DAC_m[1B]), SPI_CLK (in), SPI_MISO (out, see APP_1_PLL_m[5A]), SPI_MOSI (in)

### Nets
3V3: C63.2 C64.2 C65.2 C67.2 C68.2 C69.2 C71.2 C72.2 C73.2 C80.2 C81.2 U10.8(VCC_OUT) U10.11(VCC_OUT) U10.15(VCC_AUXOUT) U10.18(VCC_OUT) U10.21(VCC_OUT) U10.26(VCC_OUT) U10.29(VCC_OUT) U10.32(VCC_OUT) U10.44(VCC_AUXIN) Y2.2(OE) Y2.6(VDD)
A3V3: L3.2 U10.1(VCC_IN_SEC) U10.47(VCC_IN_PRI)
GND: C63.1 C64.1 C65.1 C67.1 C68.1 C69.1 C71.1 C72.1 C73.1 C75.1 C76.1 C77.1 C78.1 C79.1 C80.1 C81.1 R61.1 U10.2(SEC_REF-) U10.3(SEC_REF+) U10.36(GND_VCO) U10.43(AUX_IN) U10.PAD(GND) Y2.3(GND)
100MHz_N: U10.28(U0N) ; port 100MHz_N
100MHz_P: U10.27(U0P) ; port 100MHz_P
125MHz_N: U10.46(PRI_REF-) Y2.5(CLK-)
125MHz_P: U10.45(PRI_REF+) Y2.4(CLK+)
200MHz_N: U10.20(U1N) ; port 200MHz_N
200MHz_P: U10.19(U1P) ; port 200MHz_P
400MHz_N: U10.17(U2N) ; port 400MHz_N
400MHz_P: U10.16(U2P) ; port 400MHz_P
SPI_CLK: U10.24(SPI_CLK) ; port SPI_CLK
SPI_MISO: U10.22(SPI_MISO) U10.25(SPI_LE) ; port SPI_MISO
SPI_MOSI: U10.23(SPI_MOSI) ; port SPI_MOSI
NetC75_2: C75.2 C76.2 L3.1 U10.5(VCC1_PLL) U10.34(VCC_VCO) U10.35(VCC_VCO) U10.39(VCC2_PLL) U10.42(VCC2_PLL)
NetC77_2: C77.2 U10.48(VBB)
NetC78_2: C78.2 U10.4(REG_CAP1)
NetC79_2: C79.2 U10.38(REG_CAP2)
NetR61_2: R61.2 U10.30(TESTOUTA)

Not connected (* = marked no-connect by the designer): U10 6(U4P)* 7(U4N)* 9(U3P)* 10(U3N)* 12(~{PWRDN})* 13(AUX_OUT)* 14(~{SYNC})* 31(REF_SEL)* 33(TEST_MODE)* 37(PLL_LOCK)* 40(EXT_LFP)* 41(EXT_LFN)*; Y2 1(NC)*

### Layout directives
differential pair: 125MHz_N, 125MHz_P, (no net found under the mark)

### Notes on the sheet
- Power
- All A.Power
  PLL need filter
  +- 20mA supply
- Control
- (near L3) 3V3 Clean genre LDO
  Fc = 170Hz
- 400MHz
- 200MHz
- 100MHz
- - Disable EXT_LF
  - Loop filter : Programmable values
  - Can program PLL_Lock
- Programmer le filtre interne svp
- (near U10) - Internal termination resistor + LVDS.
  - Disable unused channel.
  - Disable Aux_out
- PLL Clock
- (near Y2) 3V3 LVDS
- (near U10) Activate PN PP for 100ohm diff term.
- (near U10) Disable the CDM and the outpur buffer for U3 and U4.
- (near U10) AUXOUTEN à 0 pour disable Output Source du AUX.
- Sheet Name
- Project Title
- Global Project
- Size
- Group
- Revision
- Date
- Sheet
- of
- Filename
- Designers

### Library data of the parts
C63-C65 C67-C69 C71-C73 C80 C81 = CAP - 0402: Precision: 10%; Current: *; CreatedBy: Jonathan Bouchard; Power: *
C75-C79 = CAP - 0603: Precision: 10%; Current: *; CreatedBy: Jonathan Bouchard; Power: *
R61 = RES - 0402: Voltage: 50V; Power: 1/16W; Current: *; CreatedBy: Jonathan Bouchard; Value: *
U10 = TIM_CDCE62005RGZT: TIM - CLK SYNTH JITTER CLEANER 3:5 - QFN-48; Voltage: 3 V ~ 3.6 V; Mfg: Texas Instruments; Current: *; Power: *; Mfg Part Number: CDCE62005RGZT; HelpURL: http://www.ti.com/lit/ds/symlink/cdce62005.pdf; CreatedBy: Jonathan Bouchard; Temperature: -40°C ~ 85°C; Value: *; Precision: *; Package: QFN-48; Supplier 1: Digikey; Supplier Part Number 1: 296-23947-1-ND
Y2 = OSC_590BD-BDG: TIM - OSC PROG 125MHz ~ 214.999MHz LVDS 3.3V 7PPM EN/DS - 6-SMD; Manufacturer #1: Silicon Labs; Current Rating: 100 mA (supply); Note: Spécifié la fréquence lors de la commande; Voltage rating: 3.3V (supply); Polarized: Yes; Value: ±7ppm (freq Stability), ±20ppm (freq stability total); Magnetic Material: UNKNOWN; GRAMS Lib Spec: 2.8; Manufacturer #2: *; Power Max: *; Part Number #1: 590BD-BDG; Part Number #2: *; HelpURL: https://www.silabs.com/documents/public/data-sheets/Si590-591.pdf; Supplier 1: Digi-Key; Supplier Part Number 1: 590BD-BDG-ND; Assembly Type: SMD; Temperature: -40°C ~ 85°C; Package: 6-SMD; CreatedBy/Date: from 590BD-CDG; Tolerance: *; VerifiedBy: Caroline Paulin / 3/10/2019; Cryo: UNKNOWN
L3 = FER - 0603: Voltage: *; CreatedBy: Jonathan Bouchard; Power: *; Precision: *

## Sheet APP_1_DAC_m.SchDoc
size Tabloid; SheetNumber: 13; SheetTotal: 15; Sheet_Name: DAC; Size: 11x17
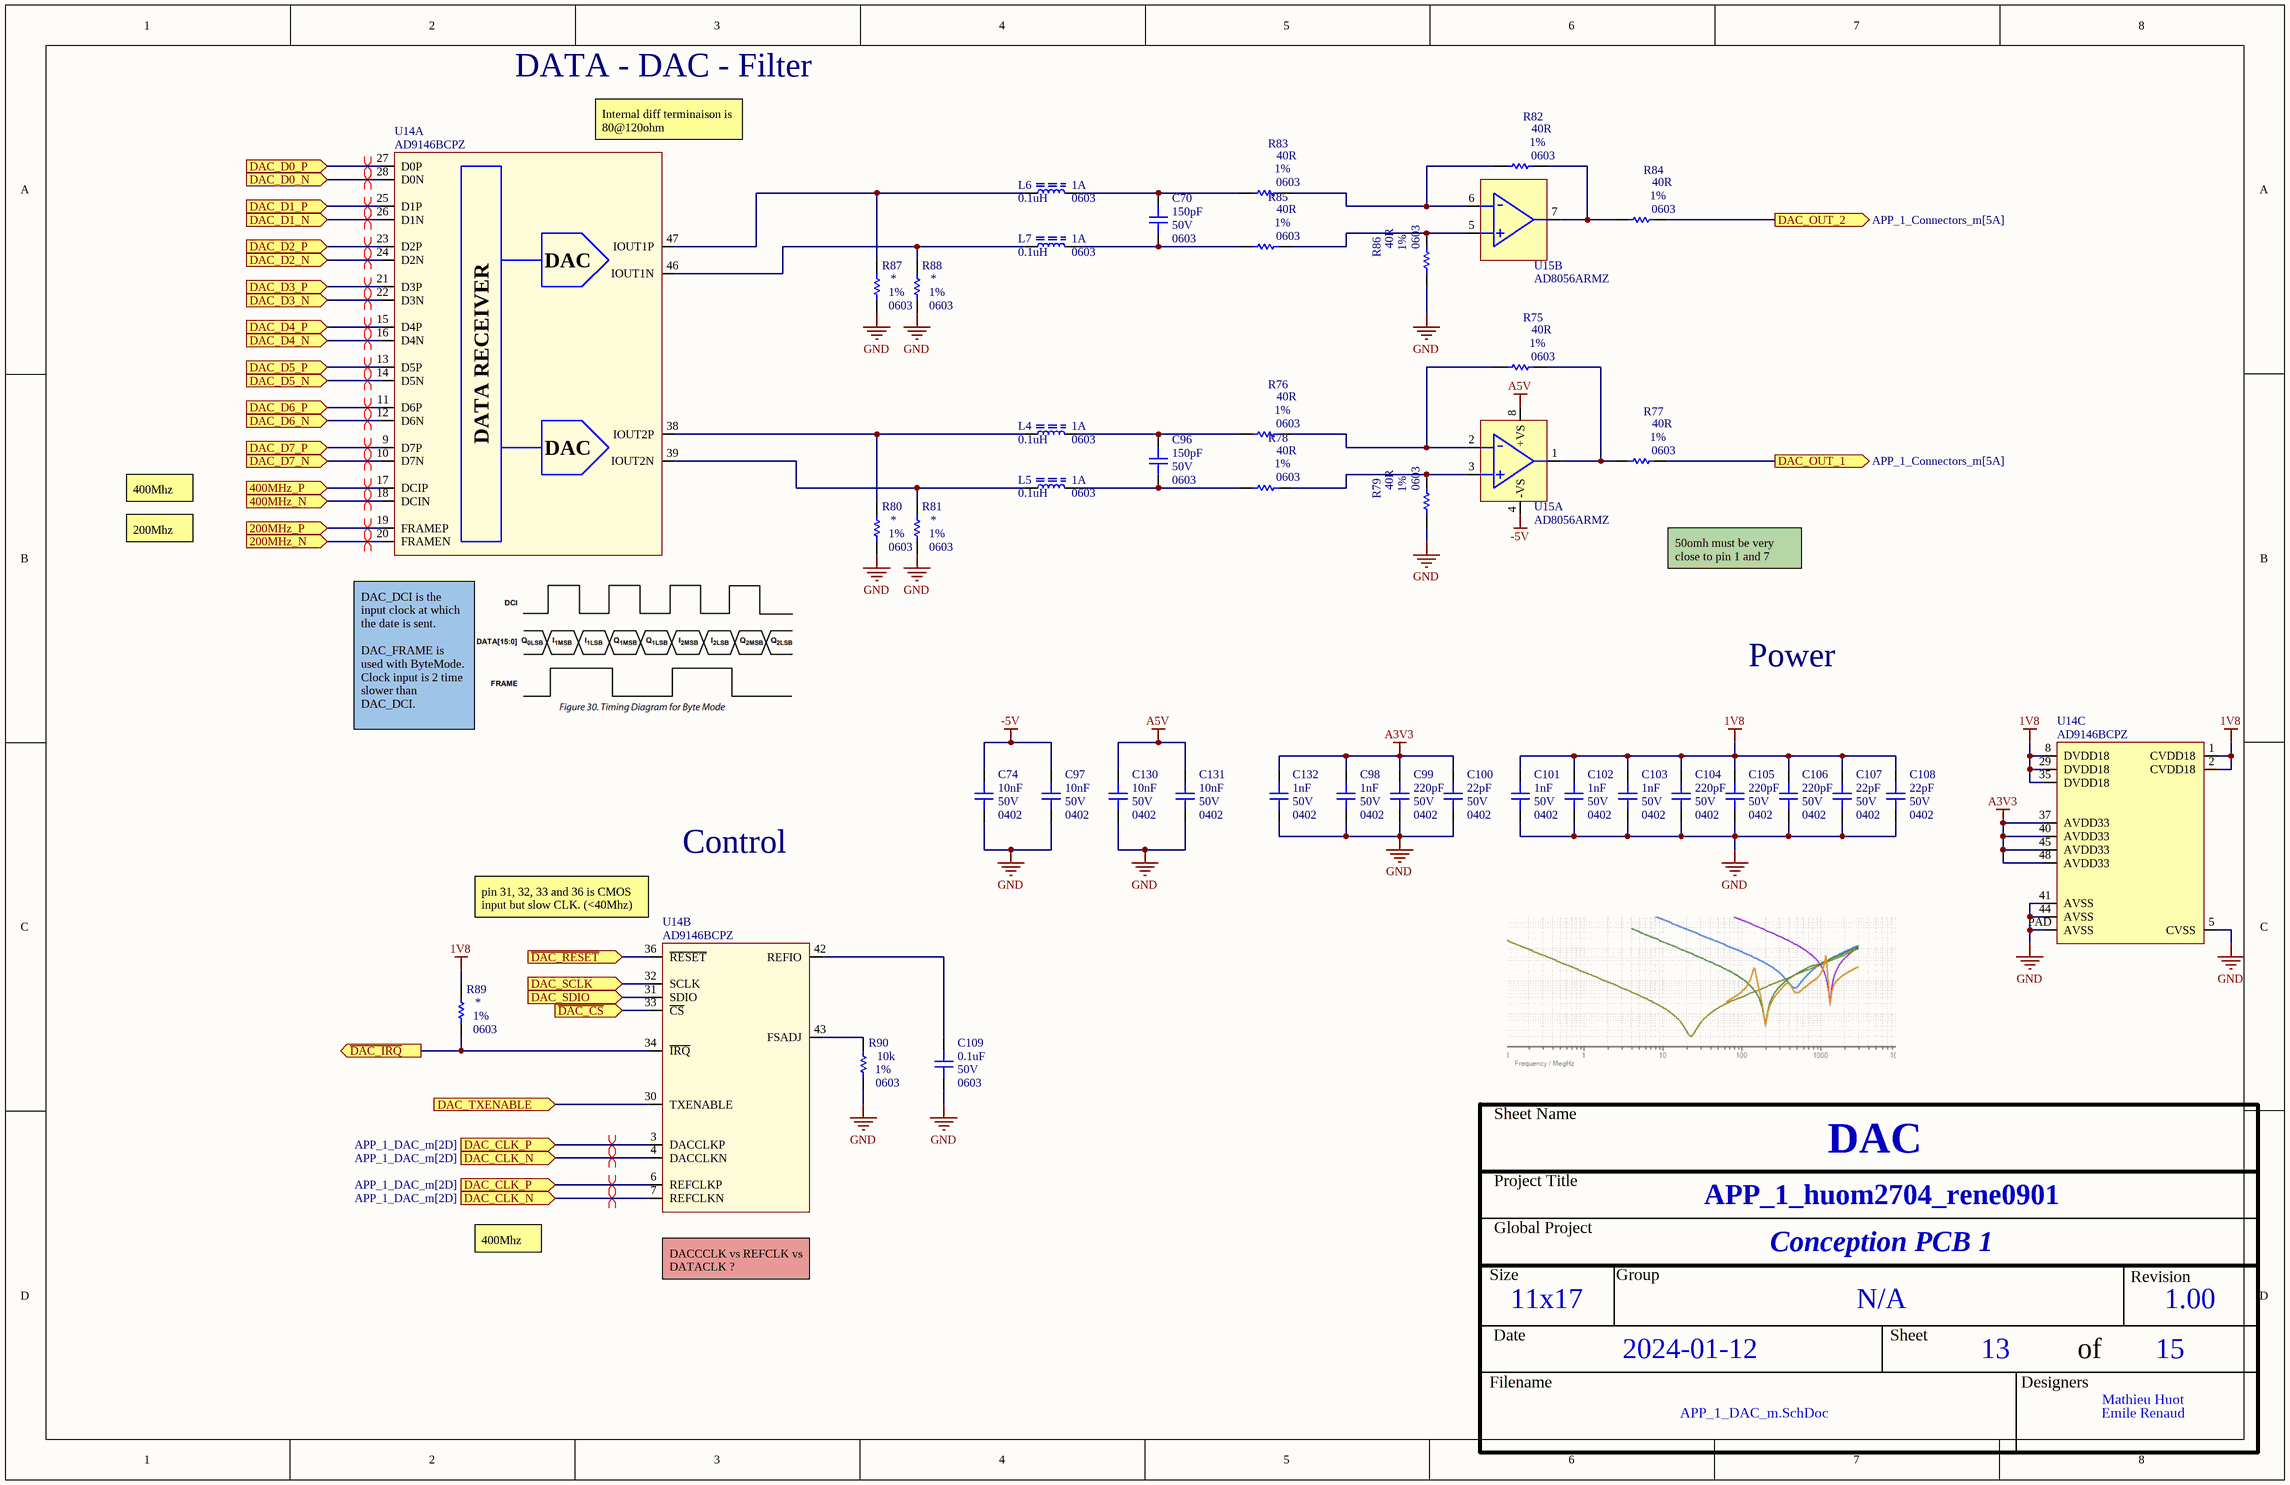
[diagram p4: APP_1_DAC_m.SchDoc]

### Parts
C70  value 150pF  Voltage: 50V  Package: 0603  [CAP_0603]  (hidden comment: CAP - 0603)
C74  value 10nF  Voltage: 50V  Package: 0402  [CAP_0402]  (hidden comment: CAP - 0402)
C96  value 150pF  Voltage: 50V  Package: 0603  [CAP_0603]  (hidden comment: CAP - 0603)
C97  value 10nF  Voltage: 50V  Package: 0402  [CAP_0402]  (hidden comment: CAP - 0402)
C98  value 1nF  Voltage: 50V  Package: 0402  [CAP_0402]  (hidden comment: CAP - 0402)
C99  value 220pF  Voltage: 50V  Package: 0402  [CAP_0402]  (hidden comment: CAP - 0402)
C100  value 22pF  Voltage: 50V  Package: 0402  [CAP_0402]  (hidden comment: CAP - 0402)
C101  value 1nF  Voltage: 50V  Package: 0402  [CAP_0402]  (hidden comment: CAP - 0402)
C102  value 1nF  Voltage: 50V  Package: 0402  [CAP_0402]  (hidden comment: CAP - 0402)
C103  value 1nF  Voltage: 50V  Package: 0402  [CAP_0402]  (hidden comment: CAP - 0402)
C104  value 220pF  Voltage: 50V  Package: 0402  [CAP_0402]  (hidden comment: CAP - 0402)
C105  value 220pF  Voltage: 50V  Package: 0402  [CAP_0402]  (hidden comment: CAP - 0402)
C106  value 220pF  Voltage: 50V  Package: 0402  [CAP_0402]  (hidden comment: CAP - 0402)
C107  value 22pF  Voltage: 50V  Package: 0402  [CAP_0402]  (hidden comment: CAP - 0402)
C108  value 22pF  Voltage: 50V  Package: 0402  [CAP_0402]  (hidden comment: CAP - 0402)
C109  value 0.1uF  Voltage: 50V  Package: 0603  [CAP_0603]  (hidden comment: CAP - 0603)
C130  value 10nF  Voltage: 50V  Package: 0402  [CAP_0402]  (hidden comment: CAP - 0402)
C131  value 10nF  Voltage: 50V  Package: 0402  [CAP_0402]  (hidden comment: CAP - 0402)
C132  value 1nF  Voltage: 50V  Package: 0402  [CAP_0402]  (hidden comment: CAP - 0402)
L4  value 0.1uH  Current: 1A  Package: 0603  [FER_0603]  (hidden comment: FER - 0603)
L5  value 0.1uH  Current: 1A  Package: 0603  [FER_0603]  (hidden comment: FER - 0603)
L6  value 0.1uH  Current: 1A  Package: 0603  [FER_0603]  (hidden comment: FER - 0603)
L7  value 0.1uH  Current: 1A  Package: 0603  [FER_0603]  (hidden comment: FER - 0603)
R75  value 40R  Package: 0603  Precision: 1%  [RES_0603]  (hidden comment: RES - 0603)
R76  value 40R  Package: 0603  Precision: 1%  [RES_0603]  (hidden comment: RES - 0603)
R77  value 40R  Package: 0603  Precision: 1%  [RES_0603]  (hidden comment: RES - 0603)
R78  value 40R  Package: 0603  Precision: 1%  [RES_0603]  (hidden comment: RES - 0603)
R79  value 40R  Package: 0603  Precision: 1%  [RES_0603]  (hidden comment: RES - 0603)
R80  Package: 0603  Precision: 1%  [RES_0603]  (hidden comment: RES - 0603)
R81  Package: 0603  Precision: 1%  [RES_0603]  (hidden comment: RES - 0603)
R82  value 40R  Package: 0603  Precision: 1%  [RES_0603]  (hidden comment: RES - 0603)
R83  value 40R  Package: 0603  Precision: 1%  [RES_0603]  (hidden comment: RES - 0603)
R84  value 40R  Package: 0603  Precision: 1%  [RES_0603]  (hidden comment: RES - 0603)
R85  value 40R  Package: 0603  Precision: 1%  [RES_0603]  (hidden comment: RES - 0603)
R86  value 40R  Package: 0603  Precision: 1%  [RES_0603]  (hidden comment: RES - 0603)
R87  Package: 0603  Precision: 1%  [RES_0603]  (hidden comment: RES - 0603)
R88  Package: 0603  Precision: 1%  [RES_0603]  (hidden comment: RES - 0603)
R89  Package: 0603  Precision: 1%  [RES_0603]  (hidden comment: RES - 0603)
R90  value 10k  Package: 0603  Precision: 1%  [RES_0603]  (hidden comment: RES - 0603)
U14  AD9146BCPZ  [DAC_AD9146BCPZ]  (parts A,B,C of 3)
U15  AD8056ARMZ  [OPAMP_AD8056ARMZ]  (parts A,B of 2)

### Ports
200MHz_N (in, see APP_1_PLL_m[3C]), 200MHz_P (in, see APP_1_PLL_m[3C]), 400MHz_N (in, see APP_1_PLL_m[3C]), 400MHz_P (in, see APP_1_PLL_m[3C]), DAC_CLK_N (in, see APP_1_DAC_m[2D]), DAC_CLK_P (in, see APP_1_DAC_m[2D]), DAC_D0_N (in), DAC_D0_P (in), DAC_D1_N (in), DAC_D1_P (in), DAC_D2_N (in), DAC_D2_P (in), DAC_D3_N (in), DAC_D3_P (in), DAC_D4_N (in), DAC_D4_P (in), DAC_D5_N (in), DAC_D5_P (in), DAC_D6_N (in), DAC_D6_P (in), DAC_D7_N (in), DAC_D7_P (in), DAC_OUT_1 (out, see APP_1_Connectors_m[5A]), DAC_OUT_2 (out, see APP_1_Connectors_m[5A]), DAC_SCLK (in), DAC_SDIO (in), DAC_TXENABLE (in), ~{DAC_CS} (in), ~{DAC_IRQ} (out), ~{DAC_RESET} (in)

### Nets
1V8: C101.2 C102.2 C103.2 C104.2 C105.2 C106.2 C107.2 C108.2 R89.2 U14.1(CVDD18) U14.2(CVDD18) U14.8(DVDD18) U14.29(DVDD18) U14.35(DVDD18)
-5V: C74.2 C97.2 U15.4(-VS)
A3V3: C98.2 C99.2 C100.2 C132.2 U14.37(AVDD33) U14.40(AVDD33) U14.45(AVDD33) U14.48(AVDD33)
A5V: C130.2 C131.2 U15.8(+VS)
GND: C74.1 C97.1 C98.1 C99.1 C100.1 C101.1 C102.1 C103.1 C104.1 C105.1 C106.1 C107.1 C108.1 C109.1 C130.1 C131.1 C132.1 R79.2 R80.1 R81.1 R86.2 R87.1 R88.1 R90.1 U14.5(CVSS) U14.41(AVSS) U14.44(AVSS) U14.PAD(AVSS)
200MHz_N: U14.20(FRAMEN) ; port 200MHz_N
200MHz_P: U14.19(FRAMEP) ; port 200MHz_P
400MHz_N: U14.18(DCIN) ; port 400MHz_N
400MHz_P: U14.17(DCIP) ; port 400MHz_P
~{DAC_CS}: U14.33(~{CS}) ; port ~{DAC_CS}
~{DAC_IRQ}: R89.1 U14.34(~{IRQ}) ; port ~{DAC_IRQ}
~{DAC_RESET}: U14.36(~{RESET}) ; port ~{DAC_RESET}
DAC_CLK_N: U14.4(DACCLKN) U14.7(REFCLKN) ; port DAC_CLK_N
DAC_CLK_P: U14.3(DACCLKP) U14.6(REFCLKP) ; port DAC_CLK_P
DAC_D0_N: U14.28(D0N) ; port DAC_D0_N
DAC_D0_P: U14.27(D0P) ; port DAC_D0_P
DAC_D1_N: U14.26(D1N) ; port DAC_D1_N
DAC_D1_P: U14.25(D1P) ; port DAC_D1_P
DAC_D2_N: U14.24(D2N) ; port DAC_D2_N
DAC_D2_P: U14.23(D2P) ; port DAC_D2_P
DAC_D3_N: U14.22(D3N) ; port DAC_D3_N
DAC_D3_P: U14.21(D3P) ; port DAC_D3_P
DAC_D4_N: U14.16(D4N) ; port DAC_D4_N
DAC_D4_P: U14.15(D4P) ; port DAC_D4_P
DAC_D5_N: U14.14(D5N) ; port DAC_D5_N
DAC_D5_P: U14.13(D5P) ; port DAC_D5_P
DAC_D6_N: U14.12(D6N) ; port DAC_D6_N
DAC_D6_P: U14.11(D6P) ; port DAC_D6_P
DAC_D7_N: U14.10(D7N) ; port DAC_D7_N
DAC_D7_P: U14.9(D7P) ; port DAC_D7_P
DAC_OUT_1: R77.1 ; port DAC_OUT_1
DAC_OUT_2: R84.1 ; port DAC_OUT_2
DAC_SCLK: U14.32(SCLK) ; port DAC_SCLK
DAC_SDIO: U14.31(SDIO) ; port DAC_SDIO
DAC_TXENABLE: U14.30(TXENABLE) ; port DAC_TXENABLE
NetC70_1: C70.1 L7.1 R85.2
NetC70_2: C70.2 L6.1 R83.2
NetC96_1: C96.1 L5.1 R78.2
NetC96_2: C96.2 L4.1 R76.2
NetC109_2: C109.2 U14.42(REFIO)
NetL4_2: L4.2 R80.2 U14.38(IOUT2P)
NetL5_2: L5.2 R81.2 U14.39(IOUT2N)
NetL6_2: L6.2 R87.2 U14.47(IOUT1P)
NetL7_2: L7.2 R88.2 U14.46(IOUT1N)
NetR75_1: R75.1 R77.2 U15.1(OUT1)
NetR75_2: R75.2 R76.1 U15.2(-IN1)
NetR78_1: R78.1 R79.1 U15.3(+IN1)
NetR82_1: R82.1 R84.2 U15.7(OUT2)
NetR82_2: R82.2 R83.1 U15.6(-IN2)
NetR85_1: R85.1 R86.1 U15.5(+IN2)
NetR90_2: R90.2 U14.43(FSADJ)

### Layout directives
differential pair: 200MHz_N, 200MHz_P, 400MHz_N, 400MHz_P, DAC_CLK_N, DAC_CLK_P, DAC_D0_N, DAC_D0_P, DAC_D1_N, DAC_D1_P, DAC_D2_N, DAC_D2_P, DAC_D3_N, DAC_D3_P, DAC_D4_N, DAC_D4_P, DAC_D5_N, DAC_D5_P, DAC_D6_N, DAC_D6_P, DAC_D7_N, DAC_D7_P

### Notes on the sheet
- DATA - DAC - Filter
- (near U14) Internal diff terminaison is 80@120ohm
- 400Mhz
- 200Mhz
- 50omh must be very close to pin 1 and 7
- Power
- (near U14) DAC_DCI is the input clock at which the date is sent.
  DAC_FRAME is used with ByteMode. Clock input is 2 time slower than DAC_DCI.
- Control
- (near U14) pin 31, 32, 33 and 36 is CMOS input but slow CLK. (<40Mhz)
- (near U14) DACCCLK vs REFCLK vs DATACLK ?
- Sheet Name
- Project Title
- Global Project
- Size
- Group
- Revision
- Date
- Sheet
- of
- Filename
- Designers
- (in symbol DAC_AD9146BCPZ, part A) DAC; DATA RECEIVER

### Library data of the parts
C70 C96 C109 = CAP - 0603: Precision: 10%; Current: *; CreatedBy: Jonathan Bouchard; Power: *
C74 C97-C108 C130-C132 = CAP - 0402: Precision: 10%; Current: *; CreatedBy: Jonathan Bouchard; Power: *
U14 = DAC_AD9146BCPZ: DAC - 16BIT SRL HIGH SPEED - QFN-48; Voltage: 3.13 V ~ 3.47 V / 1.71 V ~ 1.89 V; Mfg: Analog Devices Inc.; Current: *; Power: *; Mfg Part Number: AD9146BCPZ; HelpURL: http://www.analog.com/media/en/technical-documentation/data-sheets/AD9146.PDF; CreatedBy: Jonathan Bouchard; Temperature: -40°C ~ 85°C; Value: *; Precision: 16 Bit; Package: QFN-48; Supplier 1: Digikey; Supplier Part Number 1: AD9146BCPZ-ND
U15 = OPAMP_AD8056ARMZ: OPAMP - VFB 300MHZ - 8MSOP; Voltage: 8 V ~ 12 V, ±4 V ~ 6 V; Current: 60mA; Mfg: Analog Devices; Power: *; Mfg Part Number: AD8056ARMZ; HelpURL: http://www.analog.com/media/en/technical-documentation/data-sheets/AD8055_8056.pdf; CreatedBy: Jonathan Bouchard; Temperature: -40°C ~ 125°C; Value: *; Precision: *; Package: MSOP-8; Supplier 1: Digikey; Supplier Part Number 1: AD8056ARMZ-REEL7CT-ND
L4-L7 = FER - 0603: Voltage: *; CreatedBy: Jonathan Bouchard; Power: *; Precision: *
R75-R90 = RES - 0603: Current: *; CreatedBy: Jonathan Bouchard
  R80 R81 R87-R89: Value: *

## Sheet APP_1_ADC_m.SchDoc
size Tabloid; SheetNumber: 9; SheetTotal: 16; Sheet_Name: ADC; Size: 11x17
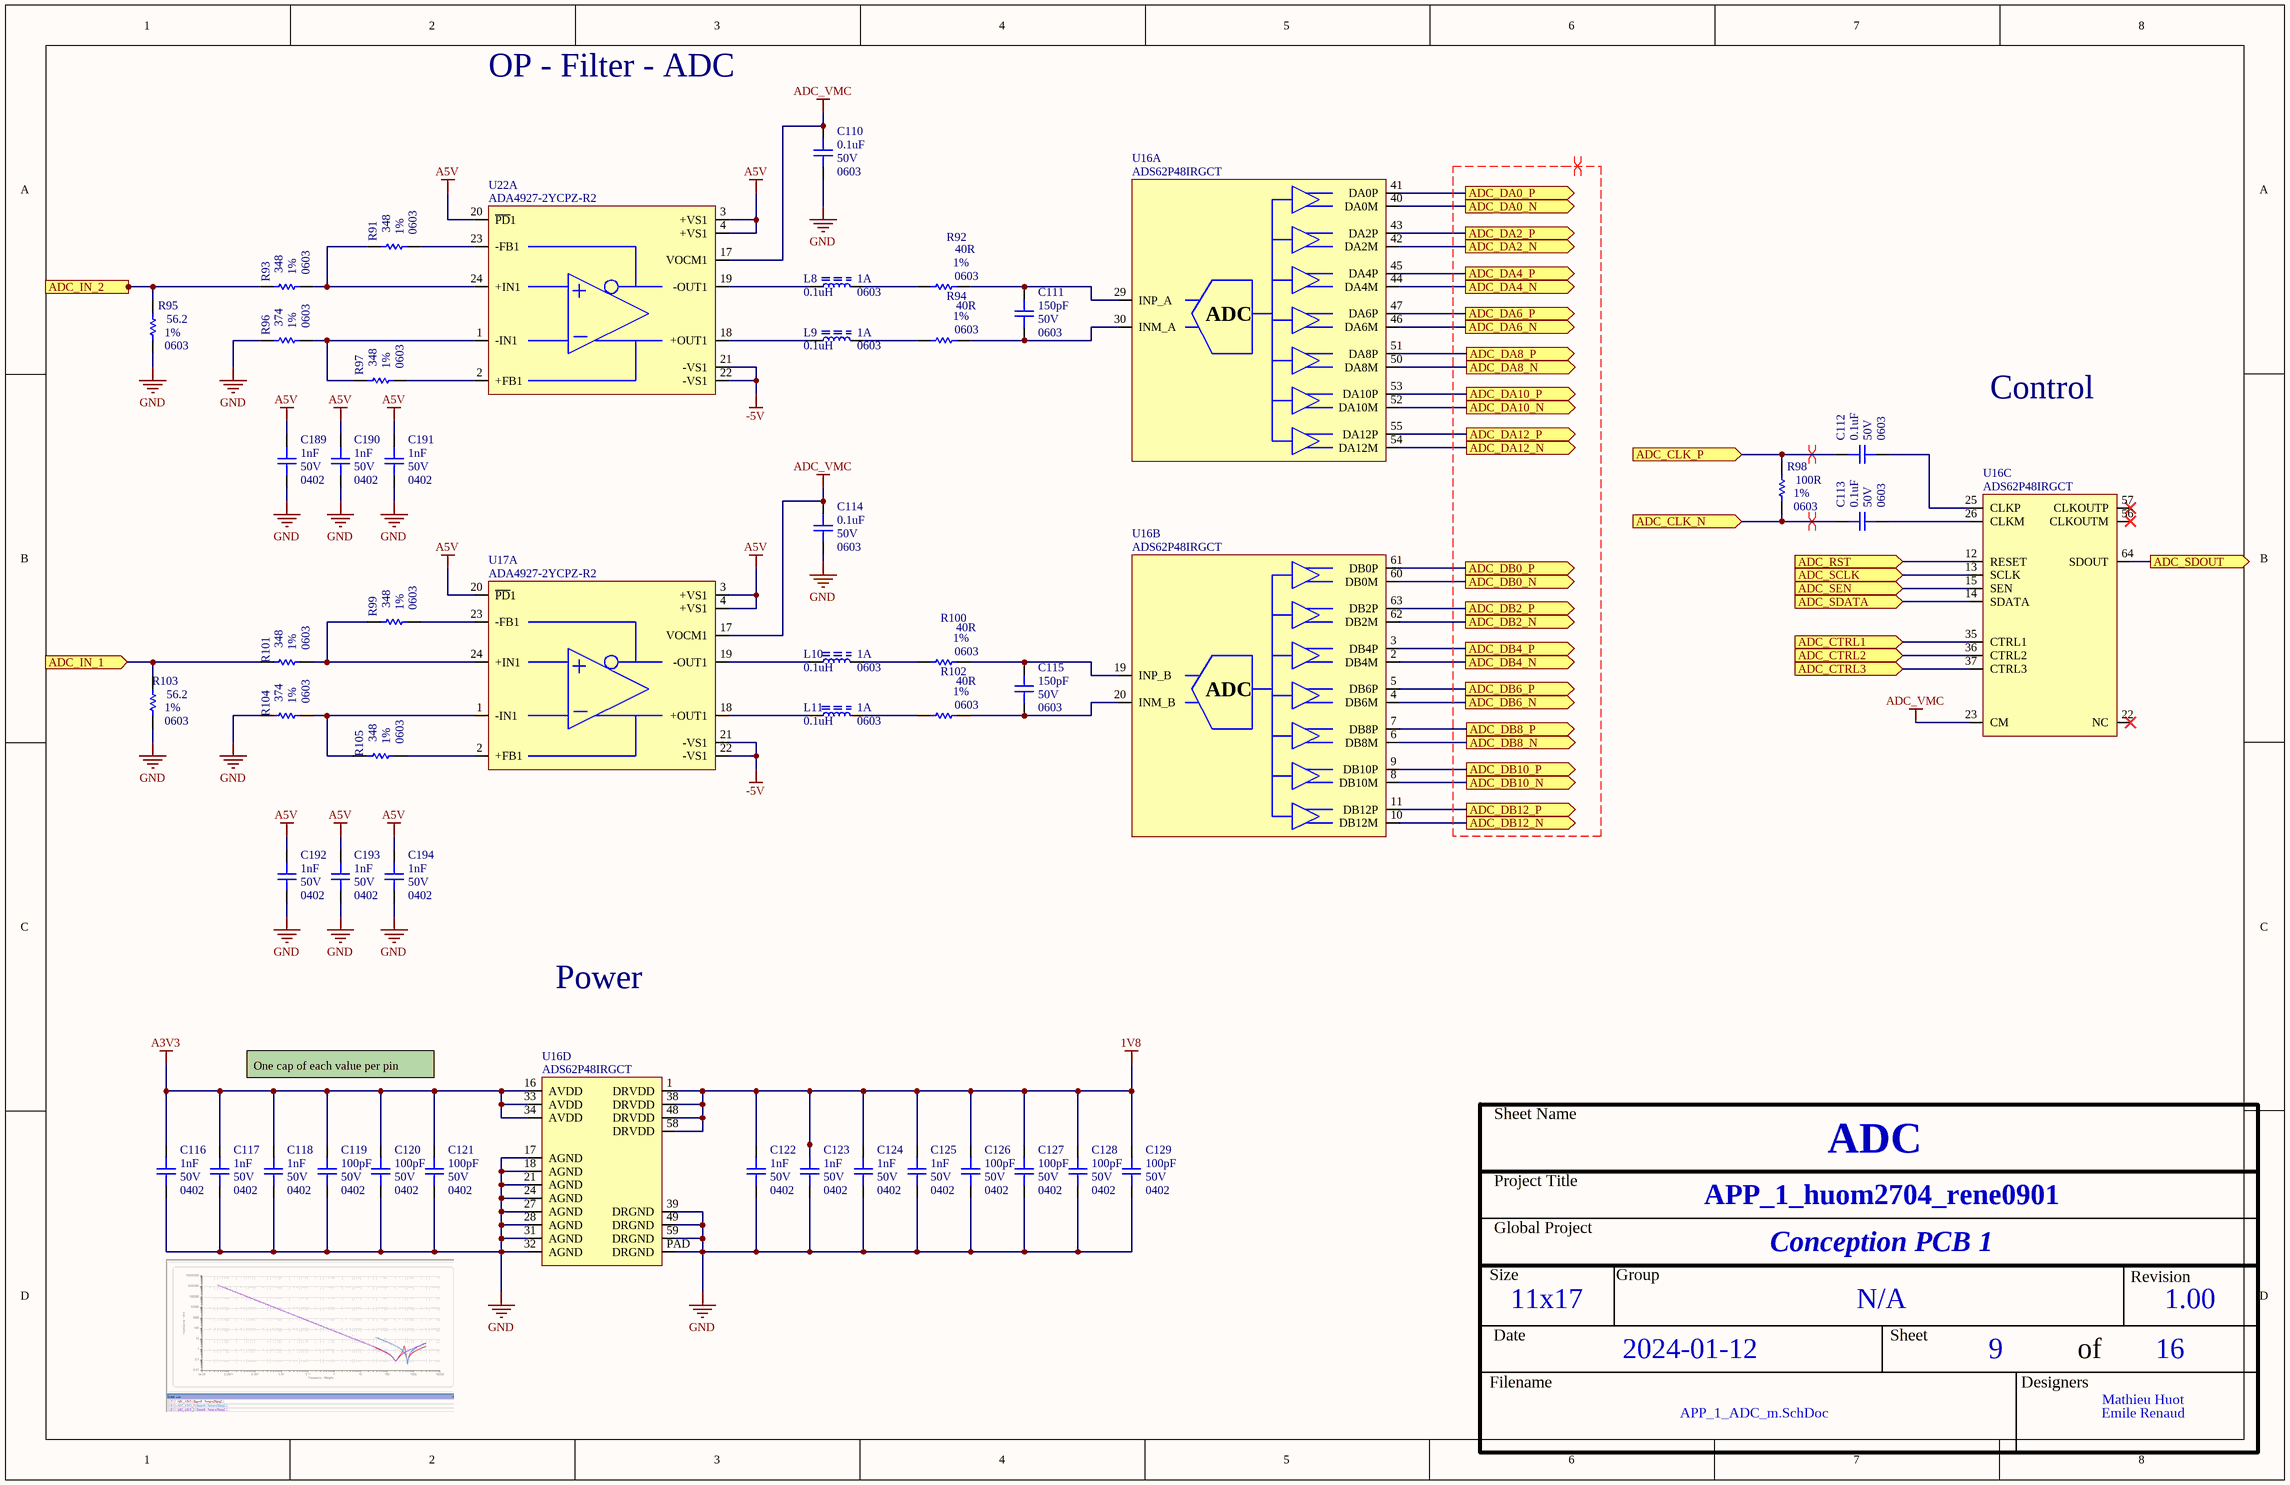
[diagram p5: APP_1_ADC_m.SchDoc]

### Parts
C110  value 0.1uF  Voltage: 50V  Package: 0603  [CAP_0603]  (hidden comment: CAP - 0603)
C111  value 150pF  Voltage: 50V  Package: 0603  [CAP_0603]  (hidden comment: CAP - 0603)
C112  value 0.1uF  Voltage: 50V  Package: 0603  [CAP_0603]  (hidden comment: CAP - 0603)
C113  value 0.1uF  Voltage: 50V  Package: 0603  [CAP_0603]  (hidden comment: CAP - 0603)
C114  value 0.1uF  Voltage: 50V  Package: 0603  [CAP_0603]  (hidden comment: CAP - 0603)
C115  value 150pF  Voltage: 50V  Package: 0603  [CAP_0603]  (hidden comment: CAP - 0603)
C116  value 1nF  Voltage: 50V  Package: 0402  [CAP_0402]  (hidden comment: CAP - 0402)
C117  value 1nF  Voltage: 50V  Package: 0402  [CAP_0402]  (hidden comment: CAP - 0402)
C118  value 1nF  Voltage: 50V  Package: 0402  [CAP_0402]  (hidden comment: CAP - 0402)
C119  value 100pF  Voltage: 50V  Package: 0402  [CAP_0402]  (hidden comment: CAP - 0402)
C120  value 100pF  Voltage: 50V  Package: 0402  [CAP_0402]  (hidden comment: CAP - 0402)
C121  value 100pF  Voltage: 50V  Package: 0402  [CAP_0402]  (hidden comment: CAP - 0402)
C122  value 1nF  Voltage: 50V  Package: 0402  [CAP_0402]  (hidden comment: CAP - 0402)
C123  value 1nF  Voltage: 50V  Package: 0402  [CAP_0402]  (hidden comment: CAP - 0402)
C124  value 1nF  Voltage: 50V  Package: 0402  [CAP_0402]  (hidden comment: CAP - 0402)
C125  value 1nF  Voltage: 50V  Package: 0402  [CAP_0402]  (hidden comment: CAP - 0402)
C126  value 100pF  Voltage: 50V  Package: 0402  [CAP_0402]  (hidden comment: CAP - 0402)
C127  value 100pF  Voltage: 50V  Package: 0402  [CAP_0402]  (hidden comment: CAP - 0402)
C128  value 100pF  Voltage: 50V  Package: 0402  [CAP_0402]  (hidden comment: CAP - 0402)
C129  value 100pF  Voltage: 50V  Package: 0402  [CAP_0402]  (hidden comment: CAP - 0402)
C189  value 1nF  Voltage: 50V  Package: 0402  [CAP_0402]  (hidden comment: CAP - 0402)
C190  value 1nF  Voltage: 50V  Package: 0402  [CAP_0402]  (hidden comment: CAP - 0402)
C191  value 1nF  Voltage: 50V  Package: 0402  [CAP_0402]  (hidden comment: CAP - 0402)
C192  value 1nF  Voltage: 50V  Package: 0402  [CAP_0402]  (hidden comment: CAP - 0402)
C193  value 1nF  Voltage: 50V  Package: 0402  [CAP_0402]  (hidden comment: CAP - 0402)
C194  value 1nF  Voltage: 50V  Package: 0402  [CAP_0402]  (hidden comment: CAP - 0402)
L8  value 0.1uH  Current: 1A  Package: 0603  [FER_0603]  (hidden comment: FER - 0603)
L9  value 0.1uH  Current: 1A  Package: 0603  [FER_0603]  (hidden comment: FER - 0603)
L10  value 0.1uH  Current: 1A  Package: 0603  [FER_0603]  (hidden comment: FER - 0603)
L11  value 0.1uH  Current: 1A  Package: 0603  [FER_0603]  (hidden comment: FER - 0603)
R91  value 348  Package: 0603  Precision: 1%  [RES_0603]  (hidden comment: RES - 0603)
R92  value 40R  Package: 0603  Precision: 1%  [RES_0603]  (hidden comment: RES - 0603)
R93  value 348  Package: 0603  Precision: 1%  [RES_0603]  (hidden comment: RES - 0603)
R94  value 40R  Package: 0603  Precision: 1%  [RES_0603]  (hidden comment: RES - 0603)
R95  value 56.2  Package: 0603  Precision: 1%  [RES_0603]  (hidden comment: RES - 0603)
R96  value 374  Package: 0603  Precision: 1%  [RES_0603]  (hidden comment: RES - 0603)
R97  value 348  Package: 0603  Precision: 1%  [RES_0603]  (hidden comment: RES - 0603)
R98  value 100R  Package: 0603  Precision: 1%  [RES_0603]  (hidden comment: RES - 0603)
R99  value 348  Package: 0603  Precision: 1%  [RES_0603]  (hidden comment: RES - 0603)
R100  value 40R  Package: 0603  Precision: 1%  [RES_0603]  (hidden comment: RES - 0603)
R101  value 348  Package: 0603  Precision: 1%  [RES_0603]  (hidden comment: RES - 0603)
R102  value 40R  Package: 0603  Precision: 1%  [RES_0603]  (hidden comment: RES - 0603)
R103  value 56.2  Package: 0603  Precision: 1%  [RES_0603]  (hidden comment: RES - 0603)
R104  value 374  Package: 0603  Precision: 1%  [RES_0603]  (hidden comment: RES - 0603)
R105  value 348  Package: 0603  Precision: 1%  [RES_0603]  (hidden comment: RES - 0603)
U16  ADS62P48IRGCT  [ADC_ADS62P48IRGCT]  (parts A,B,C,D of 4)
U17  ADA4927-2YCPZ-R2  [OPAMP_ADA4927-2YCPZ-R2]  (part A of 2)
U22  ADA4927-2YCPZ-R2  [OPAMP_ADA4927-2YCPZ-R2]  (part A of 2)

### Ports
ADC_CLK_N (in), ADC_CLK_P (in), ADC_CTRL1 (in), ADC_CTRL2 (in), ADC_CTRL3 (in), ADC_DA0_N (out), ADC_DA0_P (out), ADC_DA2_N (out), ADC_DA2_P (out), ADC_DA4_N (out), ADC_DA4_P (out), ADC_DA6_N (out), ADC_DA6_P (out), ADC_DA8_N (out), ADC_DA8_P (out), ADC_DA10_N (out), ADC_DA10_P (out), ADC_DA12_N (out), ADC_DA12_P (out), ADC_DB0_N (out), ADC_DB0_P (out), ADC_DB2_N (out), ADC_DB2_P (out), ADC_DB4_N (out), ADC_DB4_P (out), ADC_DB6_N (out), ADC_DB6_P (out), ADC_DB8_N (out), ADC_DB8_P (out), ADC_DB10_N (out), ADC_DB10_P (out), ADC_DB12_N (out), ADC_DB12_P (out), ADC_IN_1 (in, see APP_1_Connectors_m[5A]), ADC_IN_2 (in, see APP_1_Connectors_m[5A]), ADC_RST (in), ADC_SCLK (in), ADC_SDATA (in), ADC_SDOUT (out), ADC_SEN (in)

### Nets
1V8: C122.2 C123.2 C124.2 C125.2 C126.2 C127.2 C128.2 C129.2 U16.1(DRVDD) U16.38(DRVDD) U16.48(DRVDD) U16.58(DRVDD)
-5V: U17.21(-VS1) U17.22(-VS1) U22.21(-VS1) U22.22(-VS1)
A3V3: C116.2 C117.2 C118.2 C119.2 C120.2 C121.2 U16.16(AVDD) U16.33(AVDD) U16.34(AVDD)
A5V: C189.2 C190.2 C191.2 C192.2 C193.2 C194.2 U17.3(+VS1) U17.4(+VS1) U17.20(~{PD}1) U22.3(+VS1) U22.4(+VS1) U22.20(~{PD}1)
ADC_VMC: C110.2 C114.2 U16.23(CM) U17.17(VOCM1) U22.17(VOCM1)
GND: C110.1 C114.1 C116.1 C117.1 C118.1 C119.1 C120.1 C121.1 C122.1 C123.1 C124.1 C125.1 C126.1 C127.1 C128.1 C129.1 C189.1 C190.1 C191.1 C192.1 C193.1 C194.1 R95.1 R96.2 R103.1 R104.2 U16.17(AGND) U16.18(AGND) U16.21(AGND) U16.24(AGND) U16.27(AGND) U16.28(AGND) U16.31(AGND) U16.32(AGND) U16.39(DRGND) U16.49(DRGND) U16.59(DRGND) U16.PAD(DRGND)
ADC_CLK_N: C113.2 R98.1 ; port ADC_CLK_N
ADC_CLK_P: C112.2 R98.2 ; port ADC_CLK_P
ADC_CTRL1: U16.35(CTRL1) ; port ADC_CTRL1
ADC_CTRL2: U16.36(CTRL2) ; port ADC_CTRL2
ADC_CTRL3: U16.37(CTRL3) ; port ADC_CTRL3
ADC_DA0_N: U16.40(DA0M) ; port ADC_DA0_N
ADC_DA0_P: U16.41(DA0P) ; port ADC_DA0_P
ADC_DA2_N: U16.42(DA2M) ; port ADC_DA2_N
ADC_DA2_P: U16.43(DA2P) ; port ADC_DA2_P
ADC_DA4_N: U16.44(DA4M) ; port ADC_DA4_N
ADC_DA4_P: U16.45(DA4P) ; port ADC_DA4_P
ADC_DA6_N: U16.46(DA6M) ; port ADC_DA6_N
ADC_DA6_P: U16.47(DA6P) ; port ADC_DA6_P
ADC_DA8_N: U16.50(DA8M) ; port ADC_DA8_N
ADC_DA8_P: U16.51(DA8P) ; port ADC_DA8_P
ADC_DA10_N: U16.52(DA10M) ; port ADC_DA10_N
ADC_DA10_P: U16.53(DA10P) ; port ADC_DA10_P
ADC_DA12_N: U16.54(DA12M) ; port ADC_DA12_N
ADC_DA12_P: U16.55(DA12P) ; port ADC_DA12_P
ADC_DB0_N: U16.60(DB0M) ; port ADC_DB0_N
ADC_DB0_P: U16.61(DB0P) ; port ADC_DB0_P
ADC_DB2_N: U16.62(DB2M) ; port ADC_DB2_N
ADC_DB2_P: U16.63(DB2P) ; port ADC_DB2_P
ADC_DB4_N: U16.2(DB4M) ; port ADC_DB4_N
ADC_DB4_P: U16.3(DB4P) ; port ADC_DB4_P
ADC_DB6_N: U16.4(DB6M) ; port ADC_DB6_N
ADC_DB6_P: U16.5(DB6P) ; port ADC_DB6_P
ADC_DB8_N: U16.6(DB8M) ; port ADC_DB8_N
ADC_DB8_P: U16.7(DB8P) ; port ADC_DB8_P
ADC_DB10_N: U16.8(DB10M) ; port ADC_DB10_N
ADC_DB10_P: U16.9(DB10P) ; port ADC_DB10_P
ADC_DB12_N: U16.10(DB12M) ; port ADC_DB12_N
ADC_DB12_P: U16.11(DB12P) ; port ADC_DB12_P
ADC_IN_1: R101.2 R103.2 ; port ADC_IN_1
ADC_IN_2: R93.2 R95.2 ; port ADC_IN_2
ADC_RST: U16.12(RESET) ; port ADC_RST
ADC_SCLK: U16.13(SCLK) ; port ADC_SCLK
ADC_SDATA: U16.14(SDATA) ; port ADC_SDATA
ADC_SDOUT: U16.64(SDOUT) ; port ADC_SDOUT
ADC_SEN: U16.15(SEN) ; port ADC_SEN
NetC111_1: C111.1 R94.1 U16.30(INM_A)
NetC111_2: C111.2 R92.1 U16.29(INP_A)
NetC112_1: C112.1 U16.25(CLKP)
NetC113_1: C113.1 U16.26(CLKM)
NetC115_1: C115.1 R102.1 U16.20(INM_B)
NetC115_2: C115.2 R100.1 U16.19(INP_B)
NetL8_1: L8.1 R92.2
NetL8_2: L8.2 U22.19(-OUT1)
NetL9_1: L9.1 R94.2
NetL9_2: L9.2 U22.18(+OUT1)
NetL10_1: L10.1 R100.2
NetL10_2: L10.2 U17.19(-OUT1)
NetL11_1: L11.1 R102.2
NetL11_2: L11.2 U17.18(+OUT1)
NetR91_1: R91.1 U22.23(-FB1)
NetR91_2: R91.2 R93.1 U22.24(+IN1)
NetR96_1: R96.1 R97.2 U22.1(-IN1)
NetR97_1: R97.1 U22.2(+FB1)
NetR99_1: R99.1 U17.23(-FB1)
NetR99_2: R99.2 R101.1 U17.24(+IN1)
NetR104_1: R104.1 R105.2 U17.1(-IN1)
NetR105_1: R105.1 U17.2(+FB1)

Not connected (* = marked no-connect by the designer): U16 22(NC)* 56(CLKOUTM)* 57(CLKOUTP)*

### Layout directives
differential pair: (no net found under the mark), ADC_CLK_N, ADC_CLK_P

### Notes on the sheet
- OP - Filter - ADC
- Control
- Power
- One cap of each value per pin
- Sheet Name
- Project Title
- Global Project
- Size
- Group
- Revision
- Date
- Sheet
- of
- Filename
- Designers
- (in symbol ADC_ADS62P48IRGCT, part A) ADC
- (in symbol ADC_ADS62P48IRGCT, part B) ADC

### Library data of the parts
C110-C115 = CAP - 0603: Precision: 10%; Current: *; CreatedBy: Jonathan Bouchard; Power: *
C116-C129 C189-C194 = CAP - 0402: Precision: 10%; Current: *; CreatedBy: Jonathan Bouchard; Power: *
U16 = ADC_ADS62P48IRGCT: ADC - 14 BIT 210MSPS SUAL - VQFN-64; Voltage: 3.15 V ~ 3.6 V / 1.7 V ~ 1.9 V; Mfg: Texas Instruments; Precision: 14 Bit; Current: *; Power: *; Mfg Part Number: ADS62P48IRGCT; HelpURL: http://www.ti.com/lit/ds/symlink/ads62p48.pdf; CreatedBy: Jonathan Bouchard; Temperature: -40°C ~ 85°C; Value: *; Package: VQFN-64; Supplier 1: Digikey; Supplier Part Number 1: 296-24611-1-ND
U17 U22 = OPAMP_ADA4927-2YCPZ-R2: OPAMP - CFA 2.3GHZ - QFN-24; Voltage: 4.5 V ~ 11 V, ±2.25 V ~ 5.5 V; Current: 65mA; Mfg: Analog Devices; Power: *; Mfg Part Number: ADA4927-2YCPZ-R2; HelpURL: http://www.analog.com/media/en/technical-documentation/data-sheets/ADA4927-1_4927-2.pdf; CreatedBy: Jonathan Bouchard; Temperature: -40°C ~ 105°C; Value: *; Precision: *; Package: QFN-24; Supplier 1: Digikey; Supplier Part Number 1: ADA4927-2YCPZ-R2CT-ND
L8-L11 = FER - 0603: Voltage: *; CreatedBy: Jonathan Bouchard; Power: *; Precision: *
R91-R105 = RES - 0603: Current: *; CreatedBy: Jonathan Bouchard

## Sheet APP_1_JTAG_m.SchDoc
size Tabloid; SheetNumber: 14; SheetTotal: 14; Sheet_Name: JTAG; Size: 11x17
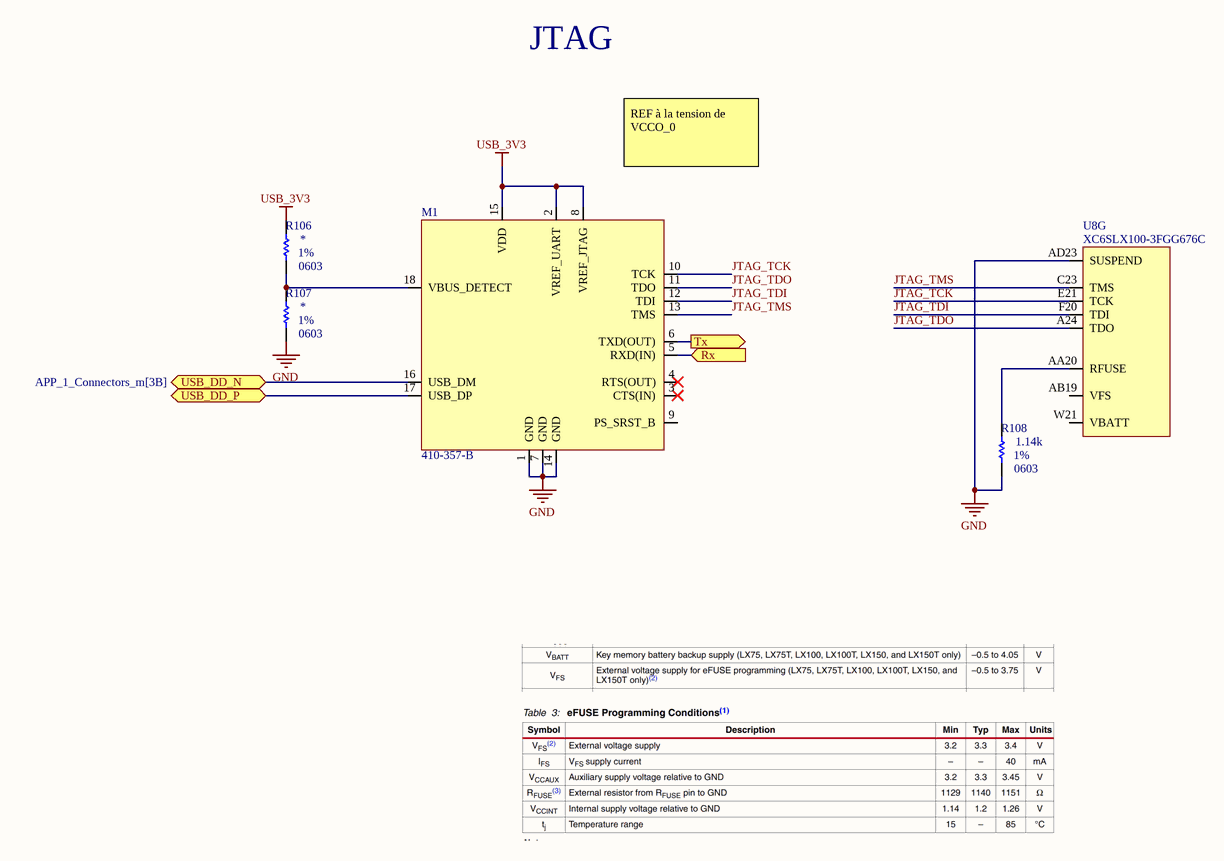
[diagram p6: APP_1_JTAG_m.SchDoc]

### Parts
M1  410-357-B  [MOD_JTAG_410-357-B]
R106  Package: 0603  Precision: 1%  [RES_0603]  (hidden comment: RES - 0603)
R107  Package: 0603  Precision: 1%  [RES_0603]  (hidden comment: RES - 0603)
R108  value 1.14k  Package: 0603  Precision: 1%  [RES_0603]  (hidden comment: RES - 0603)
U8  XC6SLX100-3FGG676C  [FPGA_XILINX_FGG676]  (part G of 10)

### Ports
Rx (in), Tx (out), USB_DD_N (bidir, see APP_1_Connectors_m[3B]), USB_DD_P (bidir, see APP_1_Connectors_m[3B])

### Nets
GND: M1.1(GND) M1.7(GND) M1.14(GND) R107.1 R108.1 U8.AD23(SUSPEND)
USB_3V3: M1.2(VREF_UART) M1.8(VREF_JTAG) M1.15(VDD) R106.2
JTAG_TCK: M1.10(TCK) U8.E21(TCK)
JTAG_TDI: M1.12(TDI) U8.F20(TDI)
JTAG_TDO: M1.11(TDO) U8.A24(TDO)
JTAG_TMS: M1.13(TMS) U8.C23(TMS)
Rx: M1.5(RXD(IN)) ; port Rx
Tx: M1.6(TXD(OUT)) ; port Tx
USB_DD_N: M1.16(USB_DM) ; port USB_DD_N
USB_DD_P: M1.17(USB_DP) ; port USB_DD_P
NetM1_18: M1.18(VBUS_DETECT) R106.1 R107.2
NetR108_2: R108.2 U8.AA20(RFUSE)

Not connected (* = marked no-connect by the designer): M1 3(CTS(IN))* 4(RTS(OUT))* 9(PS_SRST_B); U8 AB19(VFS) W21(VBATT)

### Notes on the sheet
- JTAG
- REF à la tension de VCCO_0
- Sheet Name
- Project Title
- Global Project
- Size
- Group
- Revision
- Date
- Sheet
- of
- Filename
- Designers

### Library data of the parts
M1 = MOD_JTAG_410-357-B: MOD - JTAG-SMT3-NC Programming Module For Xilinx FPGA - 18-SMT; Manufacturer #1: Digilent; Voltage Rating: VDD: 2.97V~3.63V, VJTAG/VUART: 1.65V~5.5V; GRAMS Lib Spec: 2.8; Note: Prior to reflow, the JTAG-SMT3-NC module must be dried at 125°C for 17 hours; Magnetic Material: Unknown; Polarized: Yes; Value: *; Tolerance: *; Current Rating: *; Power Max: *; HelpURL: https://reference.digilentinc.com/_media/reference/programmers/jtag-smt3/jtag-smt3-nc_rm.pdf; CreatedBy/Date: Tommy Rossignol 2018-11-23; VerifiedBy: Nicolas V. (2019-01-28); Temperature: -40°C ~ 85°C; Package: 18-pad SMT; Manufacturer #2: *; Assembly Type: SMD; Part Number #2: *; Part Number #1: 410-357-B; Supplier 1: Digi-Key; Supplier Part Number 1: 1286-1196-ND; Cryo: UNKNOWN
U8 = FPGA_XC6SLX100-3FGG676C: as U8 on sheet APP_1_FPGA_m; Current: *; Power: *; Mfg: Xilinx; Mfg Part Number: XC6SLX100-3FGG676C; HelpURL: https://www.xilinx.com/support/documentation/data_sheets/ds162.pdf; CreatedBy: Jonathan Bouchard; Temperature: 0°C ~ 85°C (TJ); Value: *; Precision: *; Package: BGA-676; Supplier 1: Digikey; Supplier Part Number 1: 122-1760-ND
R106-R108 = RES - 0603: Current: *; CreatedBy: Jonathan Bouchard
  R106 R107: Value: *